# EAGLE design Controller-Board_Rack-PDU_2.0 (EAGLE 9.2.1)

## Sheet 1 of 2: MICROCONTROLLER
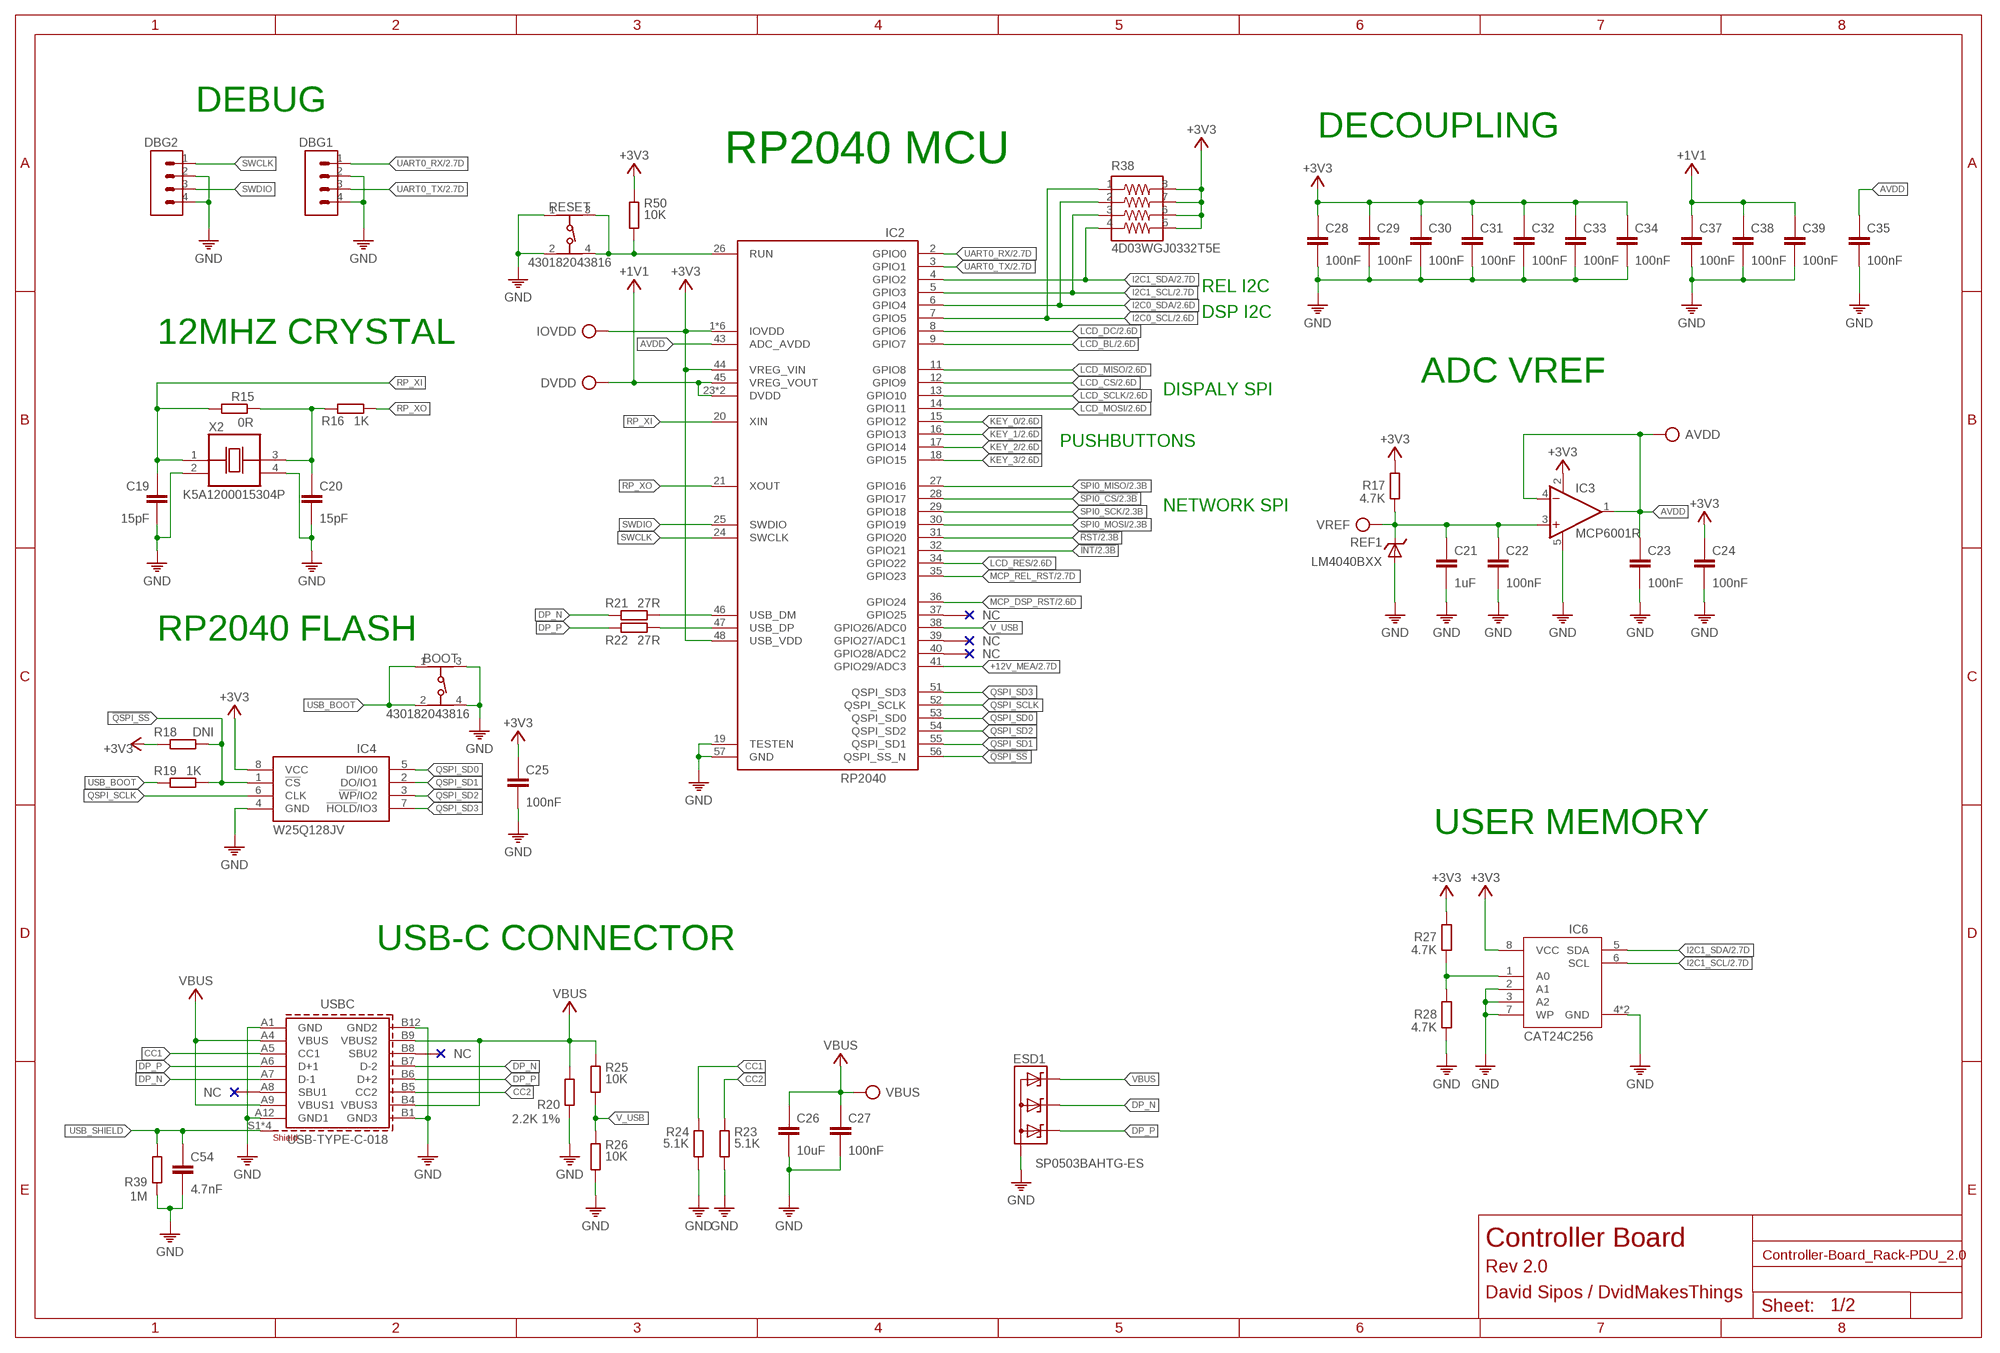
[diagram p0: schematic, sheet 1]

### Parts
AVDD  TP  [TP]
BOOT  430182043816  [430182043816]
C19  15pF  C-0402  [C0402]
C20  15pF  C-0402  [C0402]
C21  1uF  C-0402  [C0402]
C22  100nF  C-0402  [C0402]
C23  100nF  C-0402  [C0402]
C24  100nF  C-0402  [C0402]
C25  100nF  C-0402  [C0402]
C26  10uF  C0805  [0805]
C27  100nF  C0402  [0402]
C28  100nF  C-0402  [C0402]
C29  100nF  C-0402  [C0402]
C30  100nF  C-0402  [C0402]
C31  100nF  C-0402  [C0402]
C32  100nF  C-0402  [C0402]
C33  100nF  C-0402  [C0402]
C34  100nF  C-0402  [C0402]
C35  100nF  C-0402  [C0402]
C37  100nF  C-0402  [C0402]
C38  100nF  C-0402  [C0402]
C39  100nF  C-0402  [C0402]
C54  4.7nF  C0402  [0402]
DBG1  CON-1X4  [1X4]
DBG2  CON-1X4  [1X4]
DVDD  TP  [TP]
ESD1  SP0503BAHTG-ES  SP0503BAHT  [SOT143]
IC2  RP2040  [QFN40P700X700X100-57T510]
IC3  MCP6001R  MCP6001RT  [SOT23-5]
IC4  W25Q128JVPIQ  W25Q128JVP  [SON127P600X500X75-8N]
IC6  CAT24C256HU4IGT3  CAT24C256-HU4  [SON50P300X200X50-9T130X140N]
IOVDD  TP  [TP]
R15  0R  R0402  [0402]
R16  1K  R0402  [0402]
R17  4.7K  R0402  [0402]
R18  DNI  R0402  [0402]
R19  1K  R0402  [0402]
R20  2.2K 1%  R0402  [0402]
R21  27R  R0402  [0402]
R22  27R  R0402  [0402]
R23  5.1K  R0402  [0402]
R24  5.1K  R0402  [0402]
R25  10K  R0402  [0402]
R26  10K  R0402  [0402]
R27  4.7K  R0402  [0402]
R28  4.7K  R0402  [0402]
R38  4D03WGJ0332T5E  742C083103JP  [742C083103JP]
R39  1M  R0402  [0402]
R50  10K  R0402  [0402]
REF1  LM4040BXX  [SOT23]
RESET  430182043816  [430182043816]
USBC  USB-TYPE-C-018  629722000214  [629722000214]
VBUS  TP  [TP]
VREF  TP  [TP]
X2  K5A1200015304P  CRYSTAL  [OSCCC500X320X130]

### Nets
!INT: IC2.32(GPIO21) ; also sheet 2
!QSPI_SS: IC2.56(QSPI_SS_N) IC4.1(!CS) R18.1 R19.2
!RST: IC2.31(GPIO20) ; also sheet 2
!SPI0_CS: IC2.28(GPIO17) ; also sheet 2
+1V1: C37.1 C38.1 C39.1 DVDD.TP IC2.23(DVDD) IC2.45(VREG_VOUT) IC2.50(DVDD)
+3V3: C24.1 C25.1 C28.1 C29.1 C30.1 C31.1 C32.1 C33.1 C34.1 IC2.1(IOVDD) IC2.10(IOVDD) IC2.22(IOVDD) IC2.33(IOVDD) IC2.42(IOVDD) IC2.44(VREG_VIN) IC2.48(USB_VDD) IC2.49(IOVDD) IC3.2(V+) IC4.8(VCC) IC6.8(VCC) IOVDD.TP R17.2 R18.2 R27.2 R38.5 R38.6 R38.7 R38.8 R50.1 ; also sheet 2
+12V_MEA: IC2.41(GPIO29/ADC3) ; also sheet 2
AVDD: AVDD.TP C23.1 C35.1 IC2.43(ADC_AVDD) IC3.1(OUT) IC3.4(-IN)
CC1: R24.1 USBC.A5(CC1)
CC2: R23.1 USBC.B5(CC2)
DP_N [90R_DIFFPAIR]: ESD1.3(C2) R21.1 USBC.A7(D-1) USBC.B7(D-2)
DP_P [90R_DIFFPAIR]: ESD1.2(C1) R22.1 USBC.A6(D+1) USBC.B6(D+2)
GND: BOOT.3 BOOT.4 C19.2 C20.2 C21.2 C22.2 C23.2 C24.2 C25.2 C26.2 C27.2 C28.2 C29.2 C30.2 C31.2 C32.2 C33.2 C34.2 C35.2 C37.2 C38.2 C39.2 C54.2 DBG1.2 DBG1.4 DBG2.2 DBG2.4 ESD1.1(A) IC2.19(TESTEN) IC2.57(GND) IC3.5(V-) IC4.4(GND) IC6.2(A1) IC6.3(A2) IC6.4(GND) IC6.7(WP) IC6.9(GND) R20.2 R23.2 R24.2 R26.2 R28.1 R39.2 REF1.2(A) REF1.3(A) RESET.1 RESET.2 USBC.A1(GND) USBC.A12(GND1) USBC.B1(GND3) USBC.B12(GND2) X2.2(VSS) X2.4(VDD) ; also sheet 2
I2C0_SCL: IC2.7(GPIO5) R38.1 ; also sheet 2
I2C0_SDA: IC2.6(GPIO4) R38.2 ; also sheet 2
I2C1_SCL: IC2.5(GPIO3) IC6.6(SCL) R38.3 ; also sheet 2
I2C1_SDA: IC2.4(GPIO2) IC6.5(SDA) R38.4 ; also sheet 2
KEY_0: IC2.15(GPIO12) ; also sheet 2
KEY_1: IC2.16(GPIO13) ; also sheet 2
KEY_2: IC2.17(GPIO14) ; also sheet 2
KEY_3: IC2.18(GPIO15) ; also sheet 2
LCD_BL: IC2.9(GPIO7) ; also sheet 2
LCD_CS: IC2.12(GPIO9) ; also sheet 2
LCD_DC: IC2.8(GPIO6) ; also sheet 2
LCD_MISO: IC2.11(GPIO8) ; also sheet 2
LCD_MOSI: IC2.14(GPIO11) ; also sheet 2
LCD_RES: IC2.34(GPIO22) ; also sheet 2
LCD_SCLK: IC2.13(GPIO10) ; also sheet 2
MCP_DSP_RST: IC2.36(GPIO24) ; also sheet 2
MCP_REL_RST: IC2.35(GPIO23) ; also sheet 2
N$14: C20.1 R15.2 R16.1 X2.3(OUT)
N$17: IC2.26(RUN) R50.2 RESET.3 RESET.4
N$23: IC6.1(A0) R27.1 R28.2
QSPI_SCLK: IC2.52(QSPI_SCLK) IC4.6(CLK)
QSPI_SD0: IC2.53(QSPI_SD0) IC4.5(DI/IO0)
QSPI_SD1: IC2.55(QSPI_SD1) IC4.2(DO/IO1)
QSPI_SD2: IC2.54(QSPI_SD2) IC4.3(!WP!/IO2)
QSPI_SD3: IC2.51(QSPI_SD3) IC4.7(!HOLD!/IO3)
RP_XI: C19.1 IC2.20(XIN) R15.1 X2.1(CON)
RP_XO: IC2.21(XOUT) R16.2
SPI0_MISO: IC2.27(GPIO16) ; also sheet 2
SPI0_MOSI: IC2.30(GPIO19) ; also sheet 2
SPI0_SCK: IC2.29(GPIO18) ; also sheet 2
SWCLK: DBG2.1 IC2.24(SWCLK)
SWDIO: DBG2.3 IC2.25(SWDIO)
UART0_RX: DBG1.1 IC2.2(GPIO0) ; also sheet 2
UART0_TX: DBG1.3 IC2.3(GPIO1) ; also sheet 2
USB_BOOT: BOOT.1 BOOT.2 R19.1
USB_DP_N [90R_DIFFPAIR]: IC2.46(USB_DM) R21.2
USB_DP_P [90R_DIFFPAIR]: IC2.47(USB_DP) R22.2
USB_SHIELD: C54.1 R39.1 USBC.S1(SHIELD) USBC.S2(SHIELD) USBC.S3(SHIELD) USBC.S4(SHIELD)
V_USB: IC2.38(GPIO26/ADC0) R25.2 R26.1
VBUS: C26.1 C27.1 ESD1.4(C3) R20.1 R25.1 USBC.A4(VBUS) USBC.A9(VBUS1) USBC.B4(VBUS3) USBC.B9(VBUS2) VBUS.TP ; also sheet 2
VREF: C21.1 C22.1 IC3.3(+IN) R17.1 REF1.1(C) VREF.TP
Unconnected: IC2.37(GPIO25) IC2.39(GPIO27/ADC1) IC2.40(GPIO28/ADC2) USBC.A8(SBU1) USBC.B8(SBU2)

### Notes on the sheet
- DEBUG
- DECOUPLING
- RP2040 MCU
- REL I2C
- DSP I2C
- 12MHZ CRYSTAL
- ADC VREF
- DISPALY SPI
- PUSHBUTTONS
- NETWORK SPI
- RP2040 FLASH
- USER MEMORY
- USB-C CONNECTOR
- Controller Board
- Rev 2.0
- David Sipos / DvidMakesThings

## Sheet 2 of 2: NETWORK AND CONNECTORS
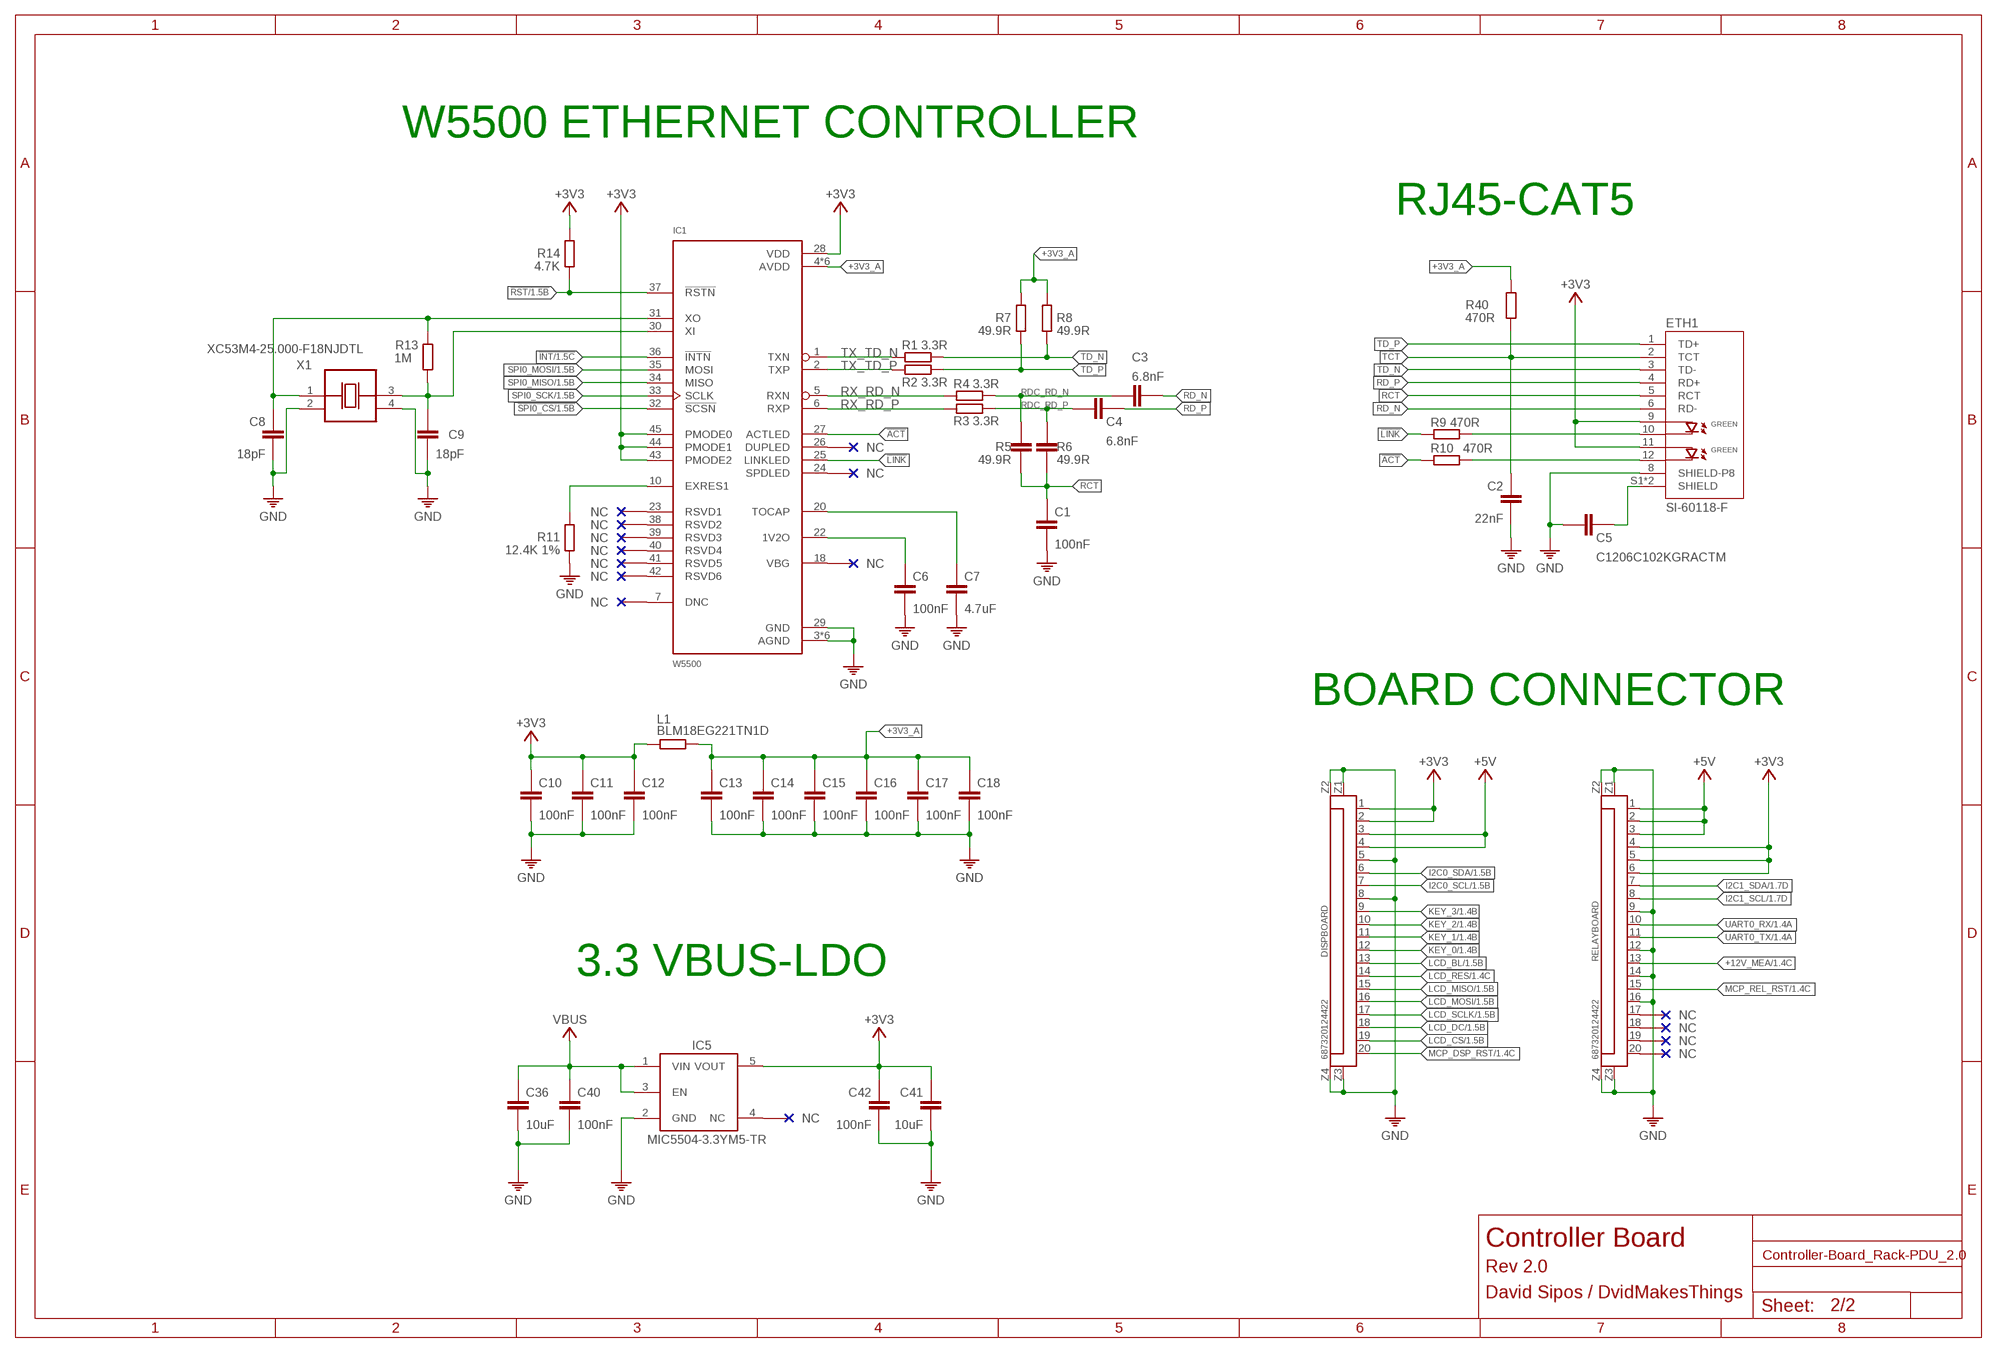
[diagram p1: schematic, sheet 2]

### Parts
C1  100nF  C-0402  [C0402]
C2  22nF  C-0402  [C0402]
C3  6.8nF  C-0402  [C0402]
C4  6.8nF  C-0402  [C0402]
C5  C1206C102KGRACTM  C-1206  [C1206]
C6  100nF  C-0402  [C0402]
C7  4.7uF  C-0402  [C0402]
C8  18pF  C-0402  [C0402]
C9  18pF  C-0402  [C0402]
C10  100nF  C-0402  [C0402]
C11  100nF  C-0402  [C0402]
C12  100nF  C-0402  [C0402]
C13  100nF  C-0402  [C0402]
C14  100nF  C-0402  [C0402]
C15  100nF  C-0402  [C0402]
C16  100nF  C-0402  [C0402]
C17  100nF  C-0402  [C0402]
C18  100nF  C-0402  [C0402]
C36  10uF  C0805  [0805]
C40  100nF  C0402  [0402]
C41  10uF  C0805  [0805]
C42  100nF  C0402  [0402]
DISPBOARD  687320124422  6873XX124422_687320124422  [687320124422]
ETH1  SI-60118-F  RJ45-CAT5  [RJ45-CAT5]
IC1  W5500  [LQFP48]
IC5  MIC5504-3.3YM5-TR  [SOT23-5]
L1  BLM18EG221TN1D  R0603  [0603]
R1  3.3R  R0402  [0402]
R2  3.3R  R0402  [0402]
R3  3.3R  R0402  [0402]
R4  3.3R  R0402  [0402]
R5  49.9R  C-0402  [C0402]
R6  49.9R  C-0402  [C0402]
R7  49.9R  R0402  [0402]
R8  49.9R  R0402  [0402]
R9  470R  R0402  [0402]
R10  470R  R0402  [0402]
R11  12.4K 1%  R0402  [0402]
R13  1M  R0402  [0402]
R14  4.7K  R0402  [0402]
R40  470R  R0402  [0402]
RELAYBOARD  687320124422  6873XX124422_687320124422  [687320124422]
X1  XC53M4-25.000-F18NJDTL  CRYSTAL  [OSCCC500X320X130]

### Nets
!ACT: IC1.27(ACTLED) R10.1
!INT: IC1.36(!INTN) ; also sheet 1
!LINK: IC1.25(LINKLED) R9.1
!RST: IC1.37(!RSTN) R14.1 ; also sheet 1
!SPI0_CS: IC1.32(!SCSN) ; also sheet 1
+3V3: C10.1 C11.1 C12.1 C41.1 C42.1 DISPBOARD.1 DISPBOARD.2 ETH1.9(GA1) ETH1.11(GA2) IC1.28(VDD) IC1.43(PMODE2) IC1.44(PMODE1) IC1.45(PMODE0) IC5.5(VOUT) L1.1 R14.2 RELAYBOARD.4 RELAYBOARD.5 RELAYBOARD.6 ; also sheet 1
+3V3_A: C13.1 C14.1 C15.1 C16.1 C17.1 C18.1 IC1.4(AVDD) IC1.8(AVDD) IC1.11(AVDD) IC1.15(AVDD) IC1.17(AVDD) IC1.21(AVDD) L1.2 R7.2 R8.2 R40.2
+5V: DISPBOARD.3 DISPBOARD.4 RELAYBOARD.1 RELAYBOARD.2 RELAYBOARD.3
+12V_MEA: RELAYBOARD.13 ; also sheet 1
CHASSIS: C5.2 ETH1.S1(SHIELD) ETH1.S2(SHIELD)
GND: C1.2 C2.2 C5.1 C6.2 C7.2 C8.2 C9.2 C10.2 C11.2 C12.2 C13.2 C14.2 C15.2 C16.2 C17.2 C18.2 C36.2 C40.2 C41.2 C42.2 DISPBOARD.5 DISPBOARD.8 DISPBOARD.Z1 DISPBOARD.Z2 DISPBOARD.Z3 DISPBOARD.Z4 ETH1.8(SHIELD-P8) IC1.3(AGND) IC1.9(AGND) IC1.14(AGND) IC1.16(AGND) IC1.19(AGND) IC1.29(GND) IC1.48(AGND) IC5.2(GND) R11.1 RELAYBOARD.9 RELAYBOARD.12 RELAYBOARD.14 RELAYBOARD.16 RELAYBOARD.Z1 RELAYBOARD.Z2 RELAYBOARD.Z3 RELAYBOARD.Z4 X1.2(VSS) X1.4(VDD) ; also sheet 1
I2C0_SCL: DISPBOARD.7 ; also sheet 1
I2C0_SDA: DISPBOARD.6 ; also sheet 1
I2C1_SCL: RELAYBOARD.8 ; also sheet 1
I2C1_SDA: RELAYBOARD.7 ; also sheet 1
KEY_0: DISPBOARD.12 ; also sheet 1
KEY_1: DISPBOARD.11 ; also sheet 1
KEY_2: DISPBOARD.10 ; also sheet 1
KEY_3: DISPBOARD.9 ; also sheet 1
LCD_BL: DISPBOARD.13 ; also sheet 1
LCD_CS: DISPBOARD.19 ; also sheet 1
LCD_DC: DISPBOARD.18 ; also sheet 1
LCD_MISO: DISPBOARD.15 ; also sheet 1
LCD_MOSI: DISPBOARD.16 ; also sheet 1
LCD_RES: DISPBOARD.14 ; also sheet 1
LCD_SCLK: DISPBOARD.17 ; also sheet 1
MCP_DSP_RST: DISPBOARD.20 ; also sheet 1
MCP_REL_RST: RELAYBOARD.15 ; also sheet 1
N$1: IC1.10(EXRES1) R11.2
N$2: ETH1.10(GK1) R9.2
N$3: ETH1.12(GK2) R10.2
N$4: C6.1 IC1.22(1V2O)
N$5: C7.1 IC1.20(TOCAP)
N$7: C9.1 IC1.30(XI) R13.1 X1.3(OUT)
RCT: C1.1 ETH1.5(RCT) R5.1 R6.1
RD_N [100R_DIFFPAIR]: C3.2 ETH1.6(RD-)
RD_P [100R_DIFFPAIR]: C4.2 ETH1.4(RD+)
RDC_RD_N [100R_DIFFPAIR]: C3.1 R4.2 R5.2
RDC_RD_P [100R_DIFFPAIR]: C4.1 R3.2 R6.2
RX_RD_N [100R_DIFFPAIR]: IC1.5(RXN) R4.1
RX_RD_P [100R_DIFFPAIR]: IC1.6(RXP) R3.1
SPI0_MISO: IC1.34(MISO) ; also sheet 1
SPI0_MOSI: IC1.35(MOSI) ; also sheet 1
SPI0_SCK: IC1.33(SCLK) ; also sheet 1
TCT: C2.1 ETH1.2(TCT) R40.1
TD_N [100R_DIFFPAIR]: ETH1.3(TD-) R1.2 R8.1
TD_P [100R_DIFFPAIR]: ETH1.1(TD+) R2.2 R7.1
TX_TD_N [100R_DIFFPAIR]: IC1.1(TXN) R1.1
TX_TD_P [100R_DIFFPAIR]: IC1.2(TXP) R2.1
UART0_RX: RELAYBOARD.10 ; also sheet 1
UART0_TX: RELAYBOARD.11 ; also sheet 1
VBUS: C36.1 C40.1 IC5.1(VIN) IC5.3(EN) ; also sheet 1
XO: C8.1 IC1.31(XO) R13.2 X1.1(CON)
Unconnected: IC1.7(DNC) IC1.18(VBG) IC1.23(RSVD1) IC1.24(SPDLED) IC1.26(DUPLED) IC1.38(RSVD2) IC1.39(RSVD3) IC1.40(RSVD4) IC1.41(RSVD5) IC1.42(RSVD6) IC5.4(NC) RELAYBOARD.17 RELAYBOARD.18 RELAYBOARD.19 RELAYBOARD.20

### Notes on the sheet
- W5500 ETHERNET CONTROLLER
- RJ45-CAT5
- BOARD CONNECTOR
- 3.3 VBUS-LDO
- Controller Board
- Rev 2.0
- David Sipos / DvidMakesThings

## Library data of the parts
AVDD DVDD IOVDD VBUS VREF = ds_passive:TP
BOOT RESET = Wurth_Switch_WS-TASV:430182043816: WS-TASV SMT Tact Switch 6x6 mm Material Properties Cover Material : Stainless Steel Properties Actuator Material:LCP Actuator Flammability :UL94 V-0 Rating Actuator Color:Black; Salmon; White Frame Material:LCP Flammability Rating:UL94 V-0 Frame Color:Black Contact Material:Stainless Steel Contact Plating:Silver Terminal Material:Copper Alloy Terminal Plating:Silver VR:12 V (DC) Contact Resistance Initial:100 mΩ Contact Resistance After Life Test:2Ω RISO:100 MΩ Withstanding Voltage:250 V (AC) Washable:No Qty.:4000;5000 Mechanical Properties Electrical Life:400; 550; 1000 Stroke :0.25 mm General Information Operating Temperature:-40 up to +85 °C Washable:No Packaging Properties Packaging:Tape and Reel <https://www.we-online.com/catalog/media/o37470v209%20Family_WS-TASV_6x6mm_SMD_Tact_Switch_4301820xx8xx.jpg> Details see: https://www.we-online.com/catalog/en/TASV_6X6_SMD/ Updated by yingchun,Shan;2020-02-18 2020(C) Würth Elektronik; DATASHEET-URL: https://www.we-online.com/redexpert/spec/430182043816?ae; HEIGHT: 4.3mm; OPERATION-FORCE: 160g; PART-NUMBER: 430182043816; QTY: 1000
C1-C42 C54 R5 R6 = ds_passive:C
DBG1 DBG2 = ds_con:CON-1X4
DISPBOARD RELAYBOARD = Wurth_Connectors_WR-FPC:6873XX124422_687320124422: WR-FPC 0.50 mm SMT ZIF Vertical KIND PROPERTIES Pitch 0.5 mm MATERIAL PROPERTIES Insulator Material LCP Contact Material Phosphor Bronze Contact Plating 100 (µ") Tin over 50 (µ") Nickel Contact Type Stamped Solder Tabs Brass <https://www.we-online.com/catalog/media/o32874v209%20Family_WE-FPC_6873xx124422.jpg> Details see: https://www.we-online.com/catalog/en/FPC_0_5_SMT_ZIF_VERTICAL_6873XX124422/ Updated by Ella Wu 2020-08-26 2020(C) Wurth Elektronik; CONTACT-RESISTANCE: 20mOhm; DATASHEET-URL: https://www.we-online.com/redexpert/spec/687320124422?ae; IR: 0.5A; L: 16.4mm; PACKAGING: Tape and Reel with Cap; PART-NUMBER: 687320124422; PINS: 20; PITCH: 0.5mm; TYPE: Vertical; WORKING-VOLTAGE: 50V(AC)
ESD1 = ds_ic_peripherals:SP0503BAHT: TVS Diode Arrays Surface Mount TVS Avalanche Diode Array
ETH1 = ds_con:RJ45-CAT5; MANUFACTURER: Bel Fuse; MAXIMUM_PACKAGE_HEIGHT: 15.21mm; PARTREV: A0; STANDARD: Manufacturer Recommendations
IC1 = ds_ic_peripherals:W5500: The W5500 chip is a Hardwired TCP/IP embedded Ethernet controller that provides easier Internet connection to embedded systems. W5500 enables users to have the Internet connectivity in their applications just by using the single chip in which TCP/IP stack, 10/100 Ethernet MAC and PHY embedded. WIZnet‘s Hardwired TCP/IP is the market-proven technology that supports TCP, UDP, IPv4, ICMP, ARP, IGMP, and PPPoE protocols. W5500 embeds the 32Kbyte internal memory buffer for the Ethernet packet processing. If you use W5500, you can implement the Ethernet application just by adding the simple socket program. It’s faster and easier way rather than using any other Embedded Ethernet solution. Users can use 8 independent hardware sockets simultaneously. SPI (Serial Peripheral Interface) is provided for easy integration with the external MCU. The W5500’s SPI supports 80 MHz speed and new efficient SPI protocol for the high speed network communication. In order to reduce power consumption of the system, W5500 provides WOL (Wake on LAN) and power down mode.
IC2 = ds_ic_mcu:RP2040
IC3 = ds_ic_opa:MCP6001RT: 1 MHz, Low-Power Op Amp
IC4 = MCU:W25Q128JV: 3V 128M-BIT SERIAL FLASH MEMORY WITH DUAL/QUAD SPI & QPI & DTR
IC5 = ds_ic_vreg:MIC5504-3.3YM5-TR: The MIC5501/2/3/4 is an advanced general-purpose LDO ideal for powering general-purpose portable devices. The MIC5501/2/3/4 family of products provides a high-performance 300mA LDO
IC6 = ds_ic_memory:CAT24C256: The CAT24C256 is a EEPROM Serial 256−Kb I2C, internally organized as 32,768 words of 8 bits each. It features a 64−byte page write buffer and supports the Standard (100 kHz), Fast (400 kHz) and Fast−Plus (1 MHz) I2C protocol. Write operations can be inhibited by taking the WP pin High (this protects the entire memory). External address pins make it possible to address up to eight CAT24C256 devices on the same bus. On−Chip ECC (Error Correction Code) makes the device suitable for high reliability applications.
L1 R1-R4 R7-R11 R13-R28 R39 R40 R50 = ds_passive:R
R38 = Resistor Array:742C083103JP: RES ARRAY 4 RES 10K OHM 1206 Manufacturer's datasheet <https://www.ctscorp.com/wp-content/uploads/74x.pdf>; CREATED_BY: PCBLayout.com; DIGIKEY_PN: 742C083103JPTR-ND; MANUFACTURER: CTS Resistor Products; MPN: 742C083103JP; PACKAGE: 1206
REF1 = ds_ic_vreg:LM4040BXX: Fixed voltage, 45-µA, precision micropower shunt voltage reference
USBC = Wurth_Connectors_WR-USB:629722000214: WR-COM USB 2.0 Type C Receptacle Horizontal SMT Kind Properties Durability 10 000 Mating cycles Gender Receptacle Type Horizontal General Information Operating Temperature -40 up to +85 °C Electrical Properties Working Voltage 20 V (DC) Withstanding Voltage 100 V (AC) Contact Resistance 40 mΩ Material Properties Insulator Material LCP Insulator Flammability Rating UL94 V-0 Insulator Color Black Contact Material Brass Contact Plating Gold over Nickel Contact Type Stamped Shielding Material Steel Shielding Plating Nickel (Ni) <https://www.we-online.com/components/media/o689297v209%20family-wr-com-629722000214.jpg> Details see: www.we-online.com/en/components/products/WR-COM_USB_20_TYPE_C_RECEPTACLE_HORIZONTAL_SMT <www.we-online.com/catalog/WR-COM_USB_20_TYPE_C_RECEPTACLE_HORIZONTAL_SMT/?utm_source=eagle_model&utm_medium=description_link&utm_campaign=eisos_eagle> Updated by Ella Wu 2023-05-30 2023 (C) Würth Elektronik; APPLICATION: USB 2.0; DATASHEET-URL: https://www.we-online.com/redexpert/spec/629722000214?ae; GERDER: Receptacle; INTERFACE-TYPE: Type C; IR: 5A; MOUNT: SMT; PACKAGING: Tape and Reel; PART-NUMBER: 629722000214; PINS: 16; TYPE: Horizontal; VALUE: 629722000214; WORKING-VOLTAGE: 20V(AC)
X1 X2 = ds_passive:CRYSTAL

## Net classes
0 default: width 0.2 mm, drill 0.15 mm, clearance 0.178 mm
1 100R_DIFFPAIR: width 0.121 mm, drill 0.15 mm, clearance 0.191 mm
2 90R_DIFFPAIR: width 0.155 mm, drill 0.15 mm, clearance 0.191 mm

## Board
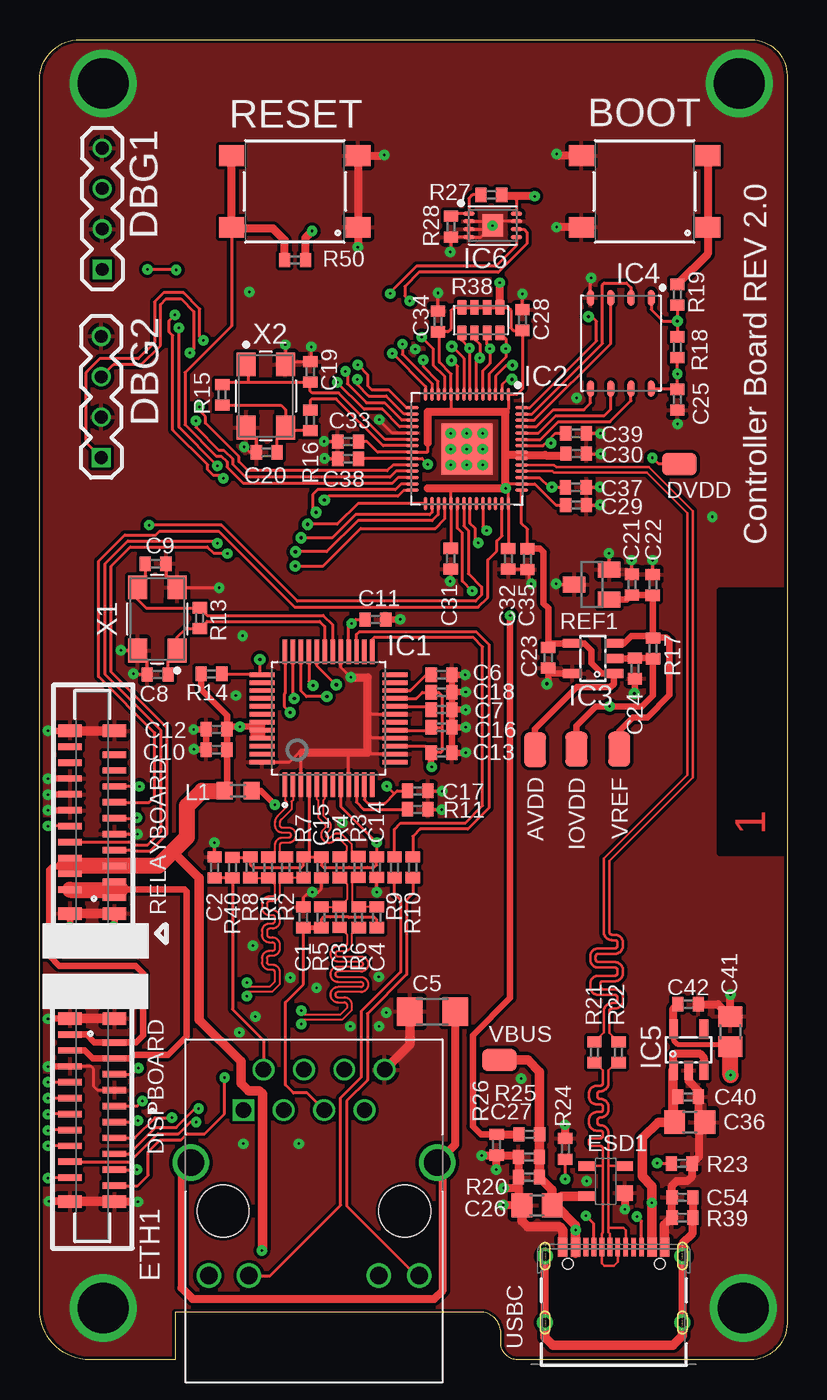
[diagram p2: board, top side]
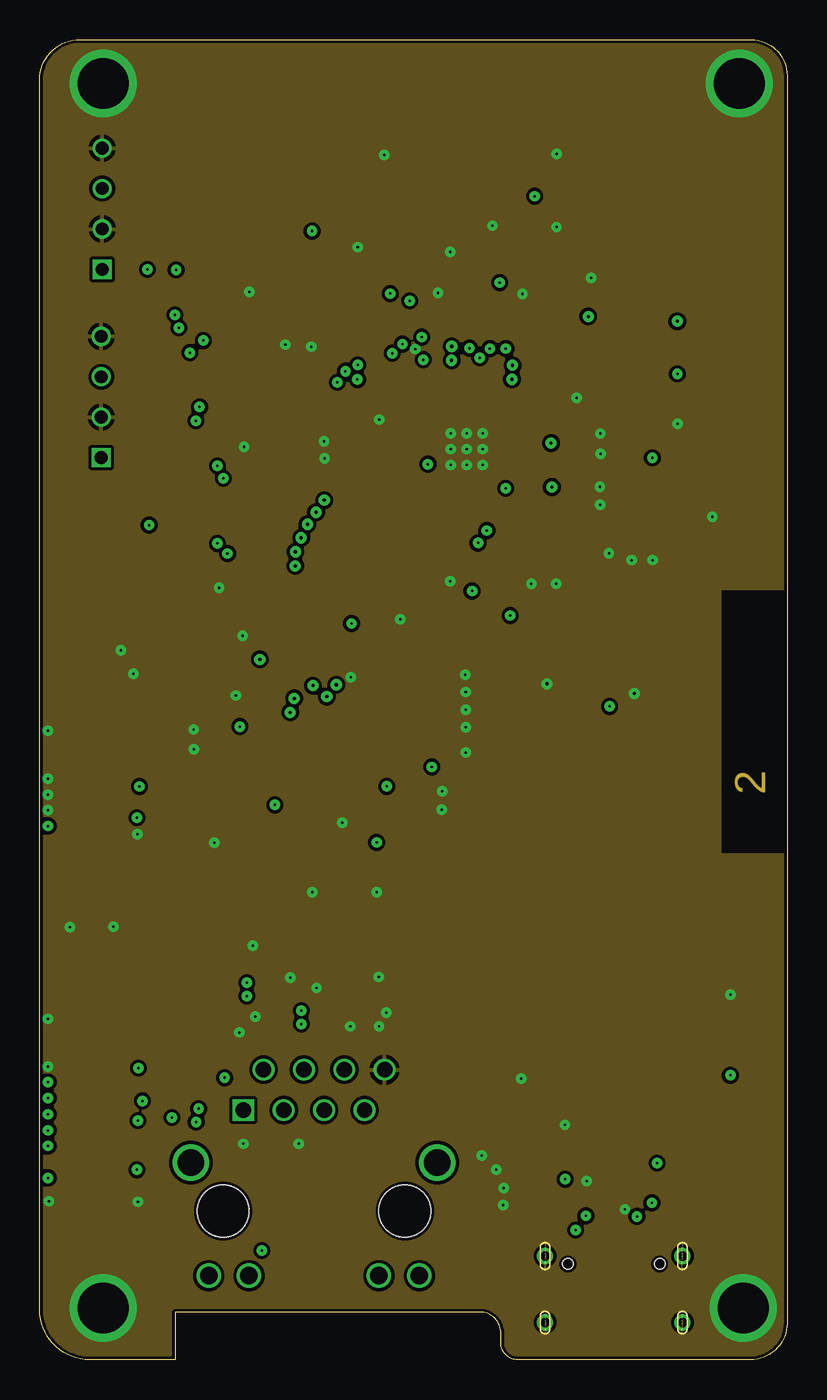
[diagram p3: board, inner layer Route2]
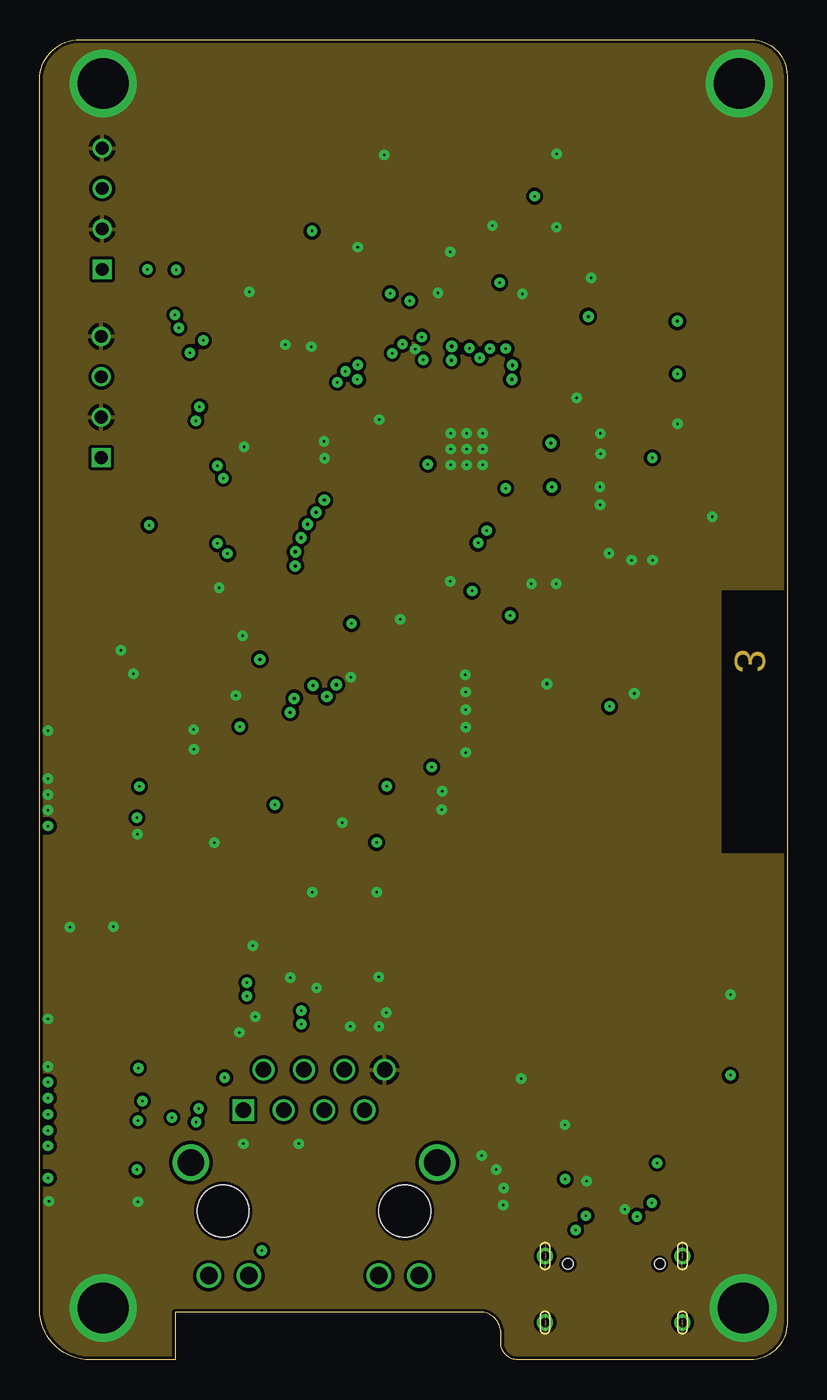
[diagram p4: board, inner layer Route15]
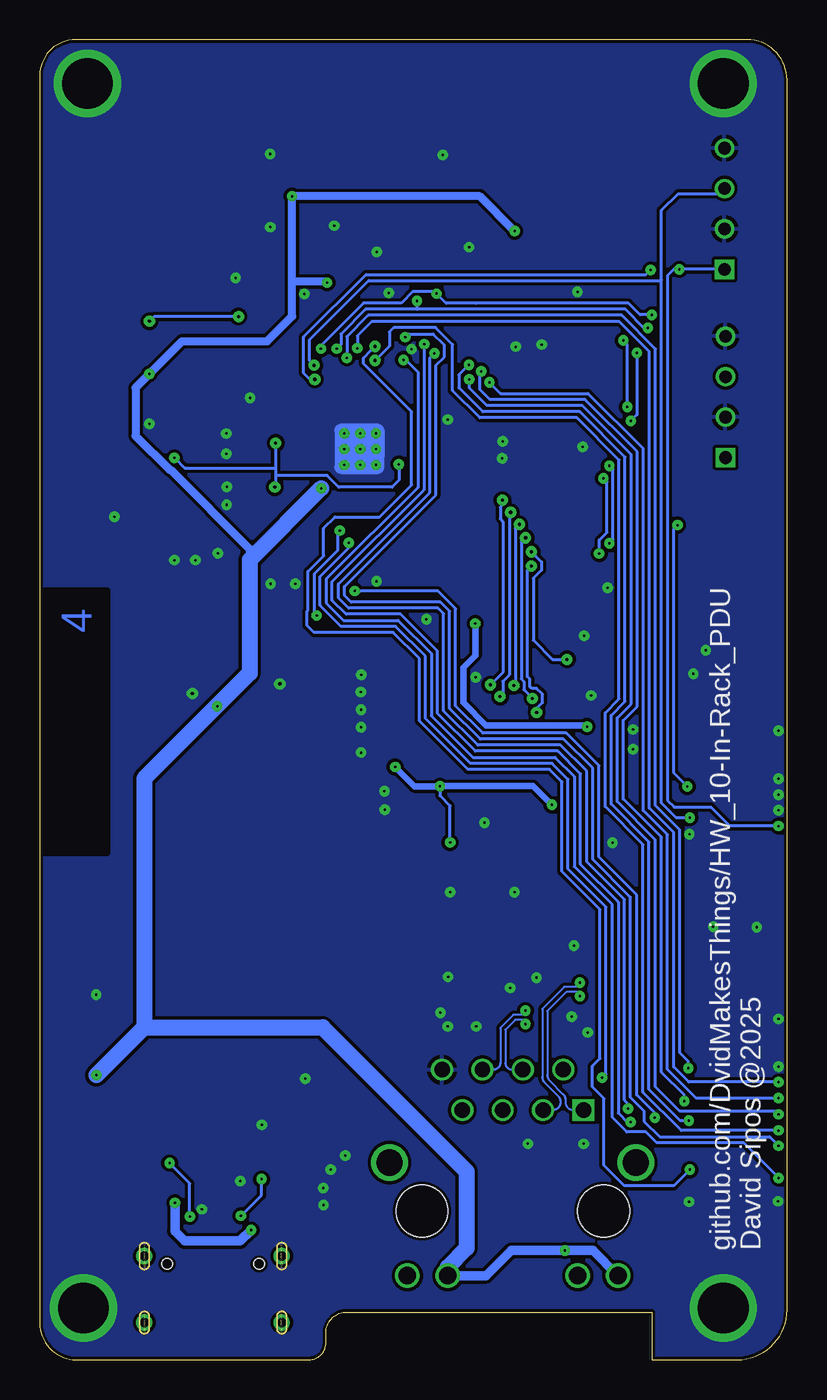
[diagram p5: board, bottom side, seen from below]

Size 47 x 83 mm. Coordinates in mm from the lower left corner, seen from the top.
Outline: 0,3.13 0,80.49 arc-90 2.51,83 44.76,83 arc-90 47,80.76 47,2.3 arc-90 44.7,0 30.06,0 arc-90 29,1.06 29,1.69 arc90 27.69,3 8.5,3 8.5,0 3.13,0 arc-90 0,3.13
Copper layers (1+2*15+16): Top 0.035mm / dielectric 0.15mm / Route2 0.0175mm / dielectric 1.265mm / Route15 0.0175mm / dielectric 0.15mm / Bottom 0.035mm
Design rules "4layers": minimum track width 3.5mil, minimum drill 0.15mm, track to track 3.5mil, track to pad 3.5mil, pad to pad 3.5mil, via to via 3.5mil, smd to smd 3.5mil, copper to edge 0.2mm, drill to drill 6mil, minimum pad ring 8mil, minimum via ring 0.25mm, stop-mask expansion 0.05mm, vias tented up to drill 16mil, thermal gap 10mil

### Footprints (pad centres in the part's own frame; a part is rotated, then mirrored left to right if it is on the bottom)
TP = smd 2.2 x 1.4: TP 0,0
430182043816 = smd 1.55 x 1.3: 1 -3.975,2.25; 2 -3.975,-2.25; 3 3.975,2.25; 4 3.975,-2.25
C0402 = smd 0.7 x 0.9: 1 -0.65,0; 2 0.65,0
C1206 = smd 1.6 x 1.803: 1 -1.422,0; 2 1.422,0
0805 = smd 1.3 x 1.5: 1 -0.95,0; 2 0.95,0
0402 = smd 0.7 x 0.9: 1 -0.65,0; 2 0.65,0
1X4 = drill 0.8 square: 1 0,3.81 | drill 0.8: 2 0,1.27; 3 0,-1.27; 4 0,-3.81
687320124422 = smd 0.4 x 1.5: 1 -4.75,-1.4; 2 -4.25,1.4; 3 -3.75,-1.4; 4 -3.25,1.4; 5 -2.75,-1.4; 6 -2.25,1.4; 7 -1.75,-1.4; 8 -1.25,1.4; 9 -0.75,-1.4; 10 -0.25,1.4; 11 0.25,-1.4; 12 0.75,1.4; 13 1.25,-1.4; 14 1.75,1.4; 15 2.25,-1.4; 16 2.75,1.4; 17 3.25,-1.4; 18 3.75,1.4; 19 4.25,-1.4; 20 4.75,1.4 | smd 0.8 x 1.5: Z1 -5.75,-1.4; Z2 -5.75,1.4; Z3 5.75,-1.4; Z4 5.75,1.4
SOT143 = smd 1 x 1: 1 -0.75,-1.2 | smd 0.6 x 1: 2 0.95,-1.2; 3 0.95,1.2; 4 -0.95,1.2
RJ45-CAT5 = drill 0.97 square: 1 -4.445,6.35 | drill 0.97: 2 -3.175,8.89; 3 -1.905,6.35; 4 -0.635,8.89; 5 0.635,6.35; 6 1.905,8.89; 7 3.175,6.35; 8 4.445,8.89 | drill 1.1: 9 -6.625,-4.06; 10 -4.085,-4.06; 11 4.085,-4.06; 12 6.625,-4.06 | drill 1.65: S1 -7.745,3.05; S2 7.745,3.05 | hole 3.25: 5.715,0; -5.715,0
LQFP48 = smd 1.56 x 0.28: 1 -4.18,2.75; 2 -4.18,2.25; 3 -4.18,1.75; 4 -4.18,1.25; 5 -4.18,0.75; 6 -4.18,0.25; 7 -4.18,-0.25; 8 -4.18,-0.75; 9 -4.18,-1.25; 10 -4.18,-1.75; 11 -4.18,-2.25; 12 -4.18,-2.75; 25 4.18,-2.75; 26 4.18,-2.25; 27 4.18,-1.75; 28 4.18,-1.25; 29 4.18,-0.75; 30 4.18,-0.25; 31 4.18,0.25; 32 4.18,0.75; 33 4.18,1.25; 34 4.18,1.75; 35 4.18,2.25; 36 4.18,2.75 | smd 0.28 x 1.56: 13 -2.75,-4.18; 14 -2.25,-4.18; 15 -1.75,-4.18; 16 -1.25,-4.18; 17 -0.75,-4.18; 18 -0.25,-4.18; 19 0.25,-4.18; 20 0.75,-4.18; 21 1.25,-4.18; 22 1.75,-4.18; 23 2.25,-4.18; 24 2.75,-4.18; 37 2.75,4.18; 38 2.25,4.18; 39 1.75,4.18; 40 1.25,4.18; 41 0.75,4.18; 42 0.25,4.18; 43 -0.25,4.18; 44 -0.75,4.18; 45 -1.25,4.18; 46 -1.75,4.18; 47 -2.25,4.18; 48 -2.75,4.18
QFN40P700X700X100-57T510 = smd 0.837 x 0.22: 1 -3.437,2.6; 2 -3.437,2.2; 3 -3.437,1.8; 4 -3.437,1.4; 5 -3.437,1; 6 -3.437,0.6; 7 -3.437,0.2; 8 -3.437,-0.2; 9 -3.437,-0.6; 10 -3.437,-1; 11 -3.437,-1.4; 12 -3.437,-1.8; 13 -3.437,-2.2; 14 -3.437,-2.6; 29 3.437,-2.6; 30 3.437,-2.2; 31 3.437,-1.8; 32 3.437,-1.4; 33 3.437,-1; 34 3.437,-0.6; 35 3.437,-0.2; 36 3.437,0.2; 37 3.437,0.6; 38 3.437,1; 39 3.437,1.4; 40 3.437,1.8; 41 3.437,2.2; 42 3.437,2.6 | smd 0.22 x 0.837: 15 -2.6,-3.437; 16 -2.2,-3.437; 17 -1.8,-3.437; 18 -1.4,-3.437; 19 -1,-3.437; 20 -0.6,-3.437; 21 -0.2,-3.437; 22 0.2,-3.437; 23 0.6,-3.437; 24 1,-3.437; 25 1.4,-3.437; 26 1.8,-3.437; 27 2.2,-3.437; 28 2.6,-3.437; 43 2.6,3.437; 44 2.2,3.437; 45 1.8,3.437; 46 1.4,3.437; 47 1,3.437; 48 0.6,3.437; 49 0.2,3.437; 50 -0.2,3.437; 51 -0.6,3.437; 52 -1,3.437; 53 -1.4,3.437; 54 -1.8,3.437; 55 -2.2,3.437; 56 -2.6,3.437 | smd 3.2 x 3.2: 57 0,0
SOT23-5 = smd 0.55 x 1.2: 1 -0.95,-1.3; 2 0,-1.3; 3 0.95,-1.3; 4 0.95,1.3; 5 -0.95,1.3
SON127P600X500X75-8N = smd 1.012 x 0.432: 1 -2.85,1.905; 2 -2.85,0.635; 3 -2.85,-0.635; 4 -2.85,-1.905; 5 2.85,-1.905; 6 2.85,-0.635; 7 2.85,0.635; 8 2.85,1.905
SON50P300X200X50-9T130X140N = smd 0.711 x 0.27: 1 -1.501,0.75; 2 -1.501,0.25; 3 -1.501,-0.25; 4 -1.501,-0.75; 5 1.501,-0.75; 6 1.501,-0.25; 7 1.501,0.25; 8 1.501,0.75 | smd 1.3 x 1.4: 9 0,0
0603 = smd 1 x 1.1: 1 -0.85,0; 2 0.85,0
742C083103JP = smd 0.59 x 0.92: 1 -1.2,-0.8; 2 -0.4,-0.8; 3 0.4,-0.8; 4 1.2,-0.8; 5 1.2,0.8; 6 0.4,0.8; 7 -0.4,0.8; 8 -1.2,0.8
SOT23 = smd 1 x 1.4: 1 -0.95,-1.1; 2 0.95,-1.1; 3 0,1.1
629722000214 = smd 0.3 x 1.15: A1 -3.35,4.745; A4 -2.55,4.745; A5 -1.25,4.745; A6 -0.25,4.745; A7 0.25,4.745; A8 1.25,4.745; A9 2.55,4.745; A12 3.35,4.745; B1 3.05,4.745; B4 2.25,4.745; B5 1.75,4.745; B6 0.75,4.745; B7 -0.75,4.745; B8 -1.75,4.745; B9 -2.25,4.745; B12 -3.05,4.745 | drill 0.6 pad 1: S1 -4.32,4.18; S2 4.32,4.18; S3 -4.32,0; S4 4.32,0 | hole 0.65: -2.89,3.68; 2.89,3.68
OSCCC500X320X130 = smd 1.487 x 1.187: 1 -1.988,-1.238; 2 1.988,-1.238; 3 1.988,1.238; 4 -1.988,1.238

### Placement (x,y rotation side)
AVDD  31.15,38.36 270 top
BOOT  38.04,73.46 180 top
C1  16.58,27.82 90 top
C2  10.99,30.95 90 top
C3  18.86,27.84 270 top
C4  20.06,27.82 270 top
C5  24.7,21.89 0 top
C6  25.27,43.07 0 top
C7  25.27,40.88 0 top
C8  7.42,43.09 180 top
C9  7.29,50.05 0 top
C10  11.12,38.36 180 top
C11  21.11,46.55 0 top
C12  11.12,39.64 180 top
C13  25.27,38.17 0 top
C14  21.19,30.97 270 top
C15  17.71,30.95 270 top
C16  25.27,39.77 0 top
C17  23.77,35.77 0 top
C18  25.27,41.97 0 top
C19  17.01,62.12 90 top
C20  14.27,57.06 180 top
C21  37.24,48.74 90 top
C22  38.55,48.72 90 top
C23  31.98,44.14 270 top
C24  37.43,43.47 270 top
C25  40.11,60.36 270 top
C26  31.27,9.71 180 top
C27  30.77,12.75 180 top
C28  30.36,65.37 90 top
C29  33.73,53.74 0 top
C30  33.73,56.98 0 top
C31  25.85,50.37 270 top
C32  29.47,50.36 270 top
C33  19.39,57.74 180 top
C34  25.04,65.28 90 top
C35  30.67,50.34 270 top
C36  40.88,14.94 0 top
C37  33.72,54.86 0 top
C38  19.4,56.65 180 top
C39  33.72,58.25 0 top
C40  40.78,16.54 0 top
C41  43.43,20.63 90 top
C42  40.78,22.36 0 top
C54  40.42,10.21 180 top
DBG1  3.93,72.37 180 top
DBG2  3.87,60.54 180 top
DISPBOARD  3.3,15.7 270 top
DVDD  40.23,56.32 0 top
ESD1  35.59,11.23 90 top
ETH1  17.25,9.35 0 top
IC1  18.17,40.33 90 top
IC2  26.87,57.27 270 top
IC3  34.8,44.1 90 top
IC4  36.55,63.92 270 top
IC5  40.81,19.49 0 top
IC6  28.49,71.33 0 top
IOVDD  33.75,38.4 270 top
L1  12.48,35.77 0 top
R1  14.38,30.95 270 top
R2  15.48,30.95 270 top
R3  20.03,30.98 270 top
R4  18.88,30.96 270 top
R5  17.7,27.82 90 top
R6  21.2,27.82 90 top
R7  16.59,30.96 90 top
R8  13.24,30.96 90 top
R9  22.31,30.96 270 top
R10  23.46,30.96 270 top
R11  23.77,34.61 180 top
R13  10.06,46.63 270 top
R14  10.8,43.13 180 top
R15  11.48,60.67 270 top
R16  17.01,59.07 90 top
R17  38.57,44.72 270 top
R18  40.11,63.67 270 top
R19  40.11,66.97 270 top
R20  30.77,11.48 180 top
R21  34.88,19.34 90 top
R22  36.4,19.34 90 top
R23  40.38,12.34 0 top
R24  33.05,13.26 90 top
R25  30.79,14.18 180 top
R26  28.73,13.52 270 top
R27  28.41,73.25 0 top
R28  25.86,71.25 90 top
R38  27.74,65.37 0 top
R39  40.42,8.94 180 top
R40  12.12,30.95 90 top
R50  16.06,69.14 180 top
REF1  34.72,48.74 90 top
RELAYBOARD  3.3,33.8 90 top
RESET  16.04,73.46 180 top
U$1  [4-LAYER]  46.58,31.86 90 top
USBC  36.1,2.34 0 top
VBUS  28.91,18.85 0 top
VREF  36.45,38.4 270 top
X1  7.39,46.58 90 top
X2  14.22,60.6 270 top

### Tracks (layer width: path | path; a pad name or v marks a point on that pad's centre or on a via)
!ACT
  Top 0.203: IC1.27 19.92,45.6 20.1,45.78 27.44,45.78 28.24,44.98 28.24,34.69 26.92,33.37 23.92,33.37 23.46,32.91 R10.1
!INT  (via drill 0.2 pad 0.3)
  Top 0.2: IC2.32 25.47,52.87 24.88,52.28 20.18,52.28 17.82,49.91 v16.07,49.91 | IC1.36 15.42,41.89 15.38,41.85 15.38,41.08 v15.75,40.71
  Bottom 0.2: v15.75,40.71 15.75,40.95 15.38,41.33 15.38,41.85 15.75,42.21 16.07,42.21 16.18,42.32 16.18,42.81 16.33,42.96 16.33,49.65 v16.07,49.91
!LINK
  Top 0.203: R9.1 22.31,33.36 22.7,33.75 26.76,33.75 27.86,34.85 27.86,44.82 27.28,45.4 21.02,45.4 20.92,45.3 IC1.25
!QSPI_SS  (via drill 0.2)
  Top 0.2: IC2.56 30.83,59.87 35.02,64.06 35.02,65.3 34.72,65.6 v34.5,65.6 | v40.1,65.3 R18.1 | IC4.1 38.45,66.05 39.2,65.3 v40.1,65.3 | R19.2 v40.1,65.3
  Bottom 0.2: v34.5,65.6 39.8,65.6 v40.1,65.3
!RST  (via drill 0.2 pad 0.3)
  Top 0.2: IC1.37 13.82,43.08 | 13.82,43.08 11.5,43.08 R14.1 | IC2.31 25.06,53.82 25.06,53.14 24.67,52.76 20,52.76 18.05,50.8 v16.08,50.8 | v13.84,44.04 13.84,43.1 13.82,43.08
  Bottom 0.2: v16.08,50.8 15.82,50.54 15.81,50.54 15.44,50.17 15.44,49.65 15.95,49.14 15.95,45.25 14.74,44.04 v13.84,44.04
!SPI0_CS  (via drill 0.2 pad 0.3)
  Top 0.2: IC1.32 17.42,43.67 v18.65,42.44 | v17.9,54.05 18.15,54.3 22.53,54.3 22.9,54.67 IC2.28
  Bottom 0.2: v18.65,42.44 17.84,43.25 17.84,52.68 18.04,52.88 18.04,53.6 17.9,53.74 v17.9,54.05
+1V1  (via drill 0.15, 0.2)
  Top 0.2: IC2.23 20.07,56.67 C38.1 | IC2.50 31.65,57.47 31.99,57.81 | 31.99,57.81 32.44,58.26 C39.1 | 31.99,57.81 v32.16,57.64
  Top 0.203: IC2.45 31.43,55.47 32.04,54.86 | 32.04,54.86 C37.1 | 32.04,54.86 32.06,54.87 v32.22,54.87 | IC2.23 24.05,56.67 v24.41,56.31 | DVDD.TP 38.93,56.32 v38.53,56.72
  Bottom 0.203: v32.16,57.64 32.16,56.07 | 32.16,56.07 32.16,55.63 | 32.16,55.63 32.16,54.93 v32.22,54.87 | v24.41,56.31 24.41,55.3 24.84,54.87 28.2,54.87 28.93,55.6 32.13,55.6 32.16,55.63 | v38.53,56.72 37.88,56.07 32.16,56.07
+3V3  (via drill 0.15)
  Top 0.2: IC2.33 25.87,51.04 C31.1 | IC2.42 C32.1 | IC2.22 21.25,57.07 20.58,57.74 C33.1 | IC2.1 30.03,60.71 30.38,61.06 30.38,64.7 C28.1 29.8,64.72 29.63,64.89 29.63,65.99 29.45,66.17 R38.5 R38.6 R38.7 R38.8 26.04,66.17 25.85,65.98 25.85,64.81 25.67,64.63 C34.1 25.13,64.55 25.13,62.72 25.87,61.98 IC2.10 | IC4.8 40.05,61.07 C25.1 v40.11,61.99 R18.2 | IC2.49 30.31,56.9 IC2.48
  Top 0.203: C29.1 32.45,53.74 31.13,55.07 IC2.44 29.33,55.07 29.3,55.1 | IC2.42 29.47,54.63 v29.3,54.8 | IC2.33 25.87,54.77 25.9,54.8 | IC2.22 24.37,57.07 24.4,57.1 24.4,57.63 24.39,57.64 | IC2.1 29.47,59.77 29.3,59.6 | IC2.10 25.87,59.67 25.8,59.6 | IC1.43 13.99,39.96 | 13.99,39.81 IC1.44 13.99,39.35 13.99,39.26 IC1.45 | IC1.28 19.42,46.1 v19.6,46.28 | C11.1 19.87,46.55 v19.61,46.29 | R27.2 29.64,73.25 29.99,72.9 IC6.8
  Top 0.305: IC5.5 39.86,20.09 40.11,19.84 43.27,19.84 C41.1 | RELAYBOARD.5 4.72,31.07 7.47,31.07
  Top 0.406: IC3.2 37.4,44.1 C24.1 38.52,44.12 R17.2 38.57,41.77 37.88,41.08 v35.84,41.08 34.98,41.08 33.75,39.85 IOVDD.TP | L1.1 11.77,35.91 C10.1 C12.1 | 13.99,39.81 13.46,39.81 | 13.46,39.81 v12.58,39.81 11.94,39.81 C12.1 | 13.99,39.35 13.58,39.35 13.48,39.25 13.46,39.27 13.46,39.81 | 13.99,39.81 13.99,39.26 | 13.99,39.81 13.99,39.96 | C12.1 11.77,40.51 10.15,42.13 R14.2 | v19.6,46.28 v19.61,46.29 | DISPBOARD.1 2.94,20.45 3.44,19.95 DISPBOARD.2 6.05,19.95 6.51,20.41 6.51,24.29 6.03,24.77 1.23,24.77 0.59,25.41 0.59,30.81 0.81,31.03 1.5,31.03 1.54,31.07 | RELAYBOARD.6 1.54,31.19 1.54,31.07 | 1.54,31.07 1.54,30.91 RELAYBOARD.4
  Top 0.508: C30.1 32.96,56.86 31.84,56.86 31.79,56.9 30.31,56.9 29.3,56.9 | 29.3,55.1 29.3,56.9 | 29.3,56.9 29.3,59.6 25.8,59.6 24.4,59.6 24.39,59.59 24.39,57.64 | 24.4,54.8 25.9,54.8 v29.3,54.8 29.3,55 | IC5.5 39.86,22.09 C42.1 | v31.13,73.16 29.14,73.16 R27.2 | R50.1 16.71,70.55 v17.13,70.97 | R38.5 28.94,67.72 v28.93,67.73
  Top 0.61: 8.37,31.96 10.04,30.29 10.04,21.38 12.67,18.75 12.67,17.38 13.15,16.9 13.81,16.9 14,16.71 14,6.9 v13.97,6.87
  Top 1.016: 1.54,31.07 7.47,31.07 8.37,31.96 9.26,32.86 9.26,34.83 10.2,35.77 L1.1 | v43.44,17.89 C41.1
  Bottom 0.406: v19.61,46.29 19.61,44.29 20.36,43.54 20.36,41.32 18.93,39.89 12.66,39.89 v12.58,39.81 | v35.84,41.08 35.84,41.14 35.47,41.51
  Bottom 0.508: 33.8,50.3 33.8,50.99 38.77,55.96 38.84,55.96 40.97,58.09 40.97,61.13 v40.11,61.99 38.06,64.04 32.7,64.04 31.13,65.61 31.13,67.79 | 31.13,67.79 v31.13,73.16 19.32,73.16 v17.13,70.97 | v28.93,67.73 28.99,67.79 31.13,67.79
  Bottom 0.61: ETH1.11 18.92,5.29 17.34,6.87 v13.97,6.87 12.21,6.87 ETH1.9
  Bottom 1.016: v29.3,54.8 33.8,50.3 33.8,43.18 35.47,41.51 40.43,36.55 40.43,20.9 | 40.43,20.9 v43.44,17.89 | 40.43,20.9 29.21,20.9 20.15,11.84 20.15,7.01 21.34,5.83 ETH1.11
+3V3_A  (via drill 0.15)
  Top 0.2: R40.2 13.22,31.59 R8.2 13.24,31.12 13.41,30.95 16.46,30.95 16.59,31.08 R7.2 | R7.2 C15.1 17.71,31.09 17.84,30.96 19.45,30.96 19.46,30.97 20.6,30.97 20.61,30.96 21.04,30.96 21.19,31.11 C14.1 v21.19,32.53 18.92,34.8 IC1.8 | IC1.4 16.92,31.94 R7.2
  Top 0.203: C17.1 22.48,35.77 22.34,35.62 | 22.34,35.62 21.7,34.99 20.64,34.99 20.42,35.21 IC1.11 | IC1.17 24.43,39.58 C16.1 25.29,39.77 | IC1.15 24.21,38.58 C13.1 25.21,38.17 25.29,38.25 25.29,39.77 | IC1.21 23.68,41.58 24.07,41.97 C18.1 25.1,41.97 25.29,41.78 25.29,39.77 | v21.83,36.05 22.26,35.62 22.34,35.62
  Top 0.406: C13.1 24.62,37.3 v24.65,37.27 | L1.2 13.91,35.77 v14.79,34.89
  Bottom 0.203: v21.83,36.05 21.83,35.47 21.19,34.83 v21.19,32.53
  Bottom 0.406: v24.65,37.27 23.43,36.05 v21.83,36.05 21.81,36.07 15.97,36.07 v14.79,34.89
+5V
  Top 0.254: RELAYBOARD.3 4.7,29.58 RELAYBOARD.1
  Top 0.406: DISPBOARD.3 2.83,19.45 3.33,18.95 DISPBOARD.4 5.71,18.95 5.94,19.18 8.07,19.18 9.23,20.34 9.23,29.46 9.11,29.58 5.21,29.58
  Top 0.813: 4.7,29.58 5.21,29.58
  Top 1.016: RELAYBOARD.2 4.67,29.55 4.7,29.58
+12V_MEA
  Top 0.203: RELAYBOARD.13 6.87,35.05 7.24,35.42 7.24,39.42 3.7,42.96 3.7,50.22 5.35,51.87 7.3,51.87 7.53,52.1 11.26,52.1 16.03,47.33 27.57,47.33 28.18,47.93 28.18,50.3 28.74,50.86 28.74,51.48 29.07,51.81 IC2.41
AVDD
  Top 0.2: C35.1 30.67,52.23 30.31,52.59 IC2.43
  Top 0.406: AVDD.TP 31.15,39.65 33.8,42.3 35.9,42.3 36.1,42.5 IC3.1 35.35,43.15 34.7,43.8 34.7,44.6 34.25,45.05 IC3.4 32.24,45.05 C23.1 31.98,47.25 31.68,47.55 31.68,50.78 31.47,50.99 C35.1
CC1  (via drill 0.15)
  Top 0.203: USBC.A5 34.85,8.55 v34.35,9.05 | v33.05,11.35 R24.1
  Bottom 0.203: v34.35,9.05 33.05,10.35 v33.05,11.35
CC2  (via drill 0.15)
  Top 0.203: USBC.B5 37.85,8.72 v37.56,9.01 | v38.83,12.36 38.85,12.34 R23.1
  Bottom 0.203: v37.56,9.01 37.56,11.09 v38.83,12.36
CHASSIS
  Top 0.508: C5.2 26.12,13.53 ETH1.S2 25.36,12.04 25.36,4.37 24.81,3.82 9.61,3.82 8.91,4.52 8.91,11.8 ETH1.S1
DP_N
  Top 0.155: ESD1.3 34.41,12.2 35.43,12.2 | 35.43,12.2 35.43,13.27 arc90 35.26,13.44 34.71,13.44 arc-90 34.54,13.61 34.54,13.75 arc-90 34.71,13.92 35.26,13.92 arc90 35.43,14.09 35.43,14.23 arc90 35.26,14.4 35.05,14.4 arc-90 34.54,14.92 34.54,15.06 arc-90 35.05,15.57 35.26,15.57 arc90 35.43,15.75 35.43,15.88 arc90 35.26,16.06 35.05,16.06 arc-90 34.54,16.57 34.54,16.71 arc-90 35.05,17.23 35.26,17.23 arc90 35.43,17.4 35.43,18.2 34.94,18.69 R21.1 | 35.43,12.2 35.43,8 35.35,7.92 USBC.B7 35.35,6.05 35.5,5.9 36.1,5.9 36.35,6.15 USBC.A7
DP_P
  Top 0.155: ESD1.2 36.77,12.2 35.77,12.2 | 35.77,12.2 35.77,14.23 arc90 35.26,14.75 arc-90 35.08,14.92 35.08,15.06 arc-90 35.26,15.23 arc90 35.77,15.75 35.77,15.88 arc90 35.26,16.4 35.25,16.4 arc-90 35.08,16.57 35.08,16.71 arc-90 35.25,16.88 35.26,16.88 arc90 35.77,17.4 35.77,18.2 36.26,18.69 R22.1 | USBC.A6 35.85,7.92 35.77,8 35.77,8.3 | 35.77,8.3 35.77,12.2 | USBC.B6 36.85,8.15 36.7,8.3 35.77,8.3
GND  (via drill 0.15, 0.2, 3.2 pad 4)
  Top 0.2: C8.2 6.76,43.98 X1.4 | C9.2 7.93,49.27 X1.2 | C20.2 13.62,57.97 X2.2 | X2.4 15.64,62.77 C19.2 | C1.2 16.58,29.06 16.91,29.39 v17.14,29.39 17.49,29.39 17.71,29.61 C15.2 | C14.2 v21.19,29.39 | C2.2 10.99,32.49 v10.98,32.51
  Top 0.203: USBC.A1 32.9,7.08 USBC.B12 | USBC.B1 39.3,7.08 USBC.A12 | IC1.29 18.92,43.56 v19.57,42.91 | IC1.14 20.72,38.08 20.62,38.18 | IC1.16 20.74,39.08 20.62,39.2 | IC1.19 20.68,40.58 20.62,40.64 | IC1.9 19.42,38.18 19.46,38.18 19.42,38.14 | IC1.3 16.42,37.93 | 16.42,37.93 16.42,38.3 15.7,37.58 IC1.48 | RELAYBOARD.9 v6.13,33.05 v6.14,33.04 | IC2.19 22.16,58.27 21.34,59.09 v21.34,59.11 | 16.42,37.93 16.48,37.99 16.48,38.18 | X1.2 11.26,48.57 v11.28,48.55 | X1.4 5.14,44.59 v5.11,44.62 | C8.2 5.93,43.09 v5.89,43.13 | REF1.2 35.82,50.69 v35.8,50.71 | C21.2 37.24,50.26 v37.22,50.28 | C22.2 v38.55,50.27 v38.54,50.28 | REF1.3 32.54,48.74 v32.48,48.8 | C32.2 30.65,49.71 C35.2 30.76,49.6 30.76,48.95 v30.92,48.79 | C31.2 25.85,48.97 v25.82,48.94 | C37.2 35.21,54.86 v35.23,54.88 | C29.2 v35.24,53.74 v35.25,53.75 | C20.2 13.2,57.06 v12.85,57.41 | C33.2 v17.88,57.74 | v17.91,56.67 18.73,56.67 C38.2 | v17.07,63.7 17.07,62.83 C19.2 | v15.44,63.83 15.46,63.81 X2.4 | C34.2 v25.05,67.08 | C28.2 v30.36,67.02 | IC4.4 34.65,67.98 v34.68,68.02 | R28.1 25.86,70.58 | 25.86,70.58 25.86,69.72 v25.81,69.67 | IC6.4 25.86,70.58 | IC6.4 IC6.3 | IC6.3 IC6.2 28.2,71.58 v28.47,71.31 28.24,71.08 | IC6.3 28.24,71.08 | IC6.4 27.74,70.58 28.24,71.08 | IC6.7 28.74,71.58 IC6.9 | DISPBOARD.8 3.64,16.95 3.39,17.2 3.39,18.28 3.22,18.45 DISPBOARD.5 | C30.2 34.4,56.96 v35.27,56.96 | C39.2 35.25,58.25 v35.26,58.24 | C17.2 25.29,35.77 v25.32,35.74 | R11.1 25.26,34.61 v25.29,34.58
  Top 0.406: IC3.5 32.32,43.15 C23.2 31.98,42.58 v31.9,42.5 | C24.2 37.43,41.93 v37.4,41.9 | C18.2 C7.2 | C7.2 C16.2 | C18.2 C6.2 v26.77,43.07 | C18.2 25.94,41.99 v26.8,41.99 | C7.2 v26.79,40.88 | C16.2 v26.78,39.77 v26.79,39.78 | C16.2 C13.2 26.77,38.16 v26.79,38.18 | v9.69,38.38 9.71,38.36 C10.2 C12.2 v9.69,39.64 v9.68,39.63 | v22.68,46.56 v22.67,46.55 C11.2 | DISPBOARD.5 v0.54,18.45 v0.53,18.44 | DISPBOARD.Z1 0.55,21.45 v0.53,21.43 | RELAYBOARD.12 v0.54,34.55 v0.53,34.56 | RELAYBOARD.14 0.55,35.55 v0.53,35.53 | RELAYBOARD.16 v0.54,36.55 v0.53,36.54 | RELAYBOARD.Z4 v0.53,39.55 | RELAYBOARD.Z1 4.7,27.29 v4.64,27.23 | RELAYBOARD.Z2 v1.9,27.19
  Top 0.508: C42.2 42.65,22.36 C41.2 43.43,22.94 v43.45,22.96 | IC5.2 40.81,17.53 41.43,16.91 C40.2 41.43,15.34 C36.2 41.47,14.58 41.47,12.78 R23.2 41.03,11.54 40.73,11.24 40.06,11.24 39.77,10.95 C54.2 R39.2 | 30.12,10.77 R20.2 C27.2 30,12.87 R26.2 28.7,12.83 | 30.12,10.77 30.12,9.91 C26.2 29.17,9.71 v29.15,9.73 | R24.2 33.05,14.75 v33.03,14.77 | 28.7,12.83 v28.7,11.96 | ESD1.1 v36.79,9.47 v36.8,9.46 | 30.12,10.77 29.19,10.77 v29.17,10.79 | 28.7,12.83 v27.79,12.83 | 19.46,38.18 20.62,38.18 20.62,39.2 20.62,40.64 20.62,42.91 v19.57,42.91 | DISPBOARD.Z4 6.15,9.95 v6.17,9.93 | DISPBOARD.Z3 v0.58,9.95 v0.57,9.96 | 16.48,38.18 19.42,38.18 | BOOT.3 v32.51,71.21 v32.5,71.22 | BOOT.4 32.63,75.71 v32.51,75.83 | v21.66,75.76 21.61,75.71 RESET.2 RESET.1 20.02,69.97 v20,69.96
  Top 0.61: C26.2 30.32,8.73 30.7,8.35 32.7,8.35 32.9,8.15 32.9,7.08 | R39.2 39.3,8.48 39.3,7.08 | C5.1 23.28,19.82 ETH1.8 | RELAYBOARD.Z2 RELAYBOARD.Z1 | RELAYBOARD.Z4 RELAYBOARD.Z3 | DISPBOARD.Z1 DISPBOARD.Z2 | DISPBOARD.Z3 DISPBOARD.Z4
  Bottom 0.813: 25.73,56.75 25.73,56.11 28.05,56.11 28.05,58.45 25.73,58.45 25.73,56.75 | 25.73,56.75 27.69,56.75 27.69,57.47 26.11,57.47 26.11,58.04 27.57,58.04
  other vias: 17.41,23.38 21.32,24.07 15.76,24.02 13.4,26.03 13.55,21.58 19.54,20.96 21.34,20.96 21.8,21.82 40.11,58.85 26.85,57.26 25.85,57.26 25.85,58.26 26.85,58.26 27.85,58.26 27.85,57.26 27.85,56.26 26.85,56.26 25.85,56.26 4,3.25 44.25,3.25 4,80.25 44,80.25 12.8,13.58 16.3,13.58 12.55,20.58 19.03,33.77 12.76,45.53 12.33,41.77 33.77,60.49 23.62,63.55 13.18,67.15 30.29,17.67 34.39,11.24 42.3,53.01
  pour Route2 (isolate 0.203): -5.26,83.75 47.5,83.75 47.5,48.5 42.75,48.5 42.75,31.75 47.5,31.75 47.5,31.5 47.41,-0.25 -5.26,-0.25
  pour Top (isolate 0.203): -6.01,83.65 47.5,83.65 47.5,48.5 42.75,48.5 42.75,31.75 47.5,31.75 47.48,-0.3 -6.01,-0.3
  pour Route15 (isolate 0.203): -4.75,83.7 47.36,83.7 47.5,48.5 42.75,48.5 42.75,31.75 47.5,31.75 47.5,-0.22 -4.75,-0.22
  pour Bottom (isolate 0.203): -3.68,83.65 47.46,83.65 47.5,48.5 42.75,48.5 42.75,31.75 47.5,31.75 47.5,-0.21 -3.68,-0.21
I2C0_SCL  (via drill 0.15)
  Top 0.2: R38.1 26.54,64.11 26.96,63.69 27.07,63.58 IC2.7
  Top 0.203: DISPBOARD.7 v0.54,17.45 v0.53,17.46 | v27.02,63.6 26.96,63.66 26.96,63.69
  Bottom 0.203: v0.53,17.46 6.18,17.46 7.13,18.41 7.13,33.16 8.66,34.69 8.66,63.39 10.56,65.29 26.13,65.29 27.02,64.39 v27.02,63.6
I2C0_SDA  (via drill 0.15)
  Top 0.2: 27.34,64.19 R38.2 | IC2.6 27.47,62.79
  Top 0.203: DISPBOARD.6 5.82,17.95 v6.21,18.34 | 27.47,62.79 v27.68,63 27.68,63.85 27.34,64.19
  Bottom 0.203: v6.21,18.34 6.21,18.76 6.75,19.3 6.75,33.32 8.28,34.85 8.28,63.55 10.4,65.67 26.34,65.67 27.68,64.33 v27.68,63
I2C1_SCL  (via drill 0.15)
  Top 0.2: R38.3 28.14,63.83 28.31,63.66 v28.31,63.58 28.31,62.64 27.87,62.19 IC2.5
  Top 0.203: RELAYBOARD.8 5.72,32.55 5.89,32.38 6.79,32.38 7.62,33.21 7.62,39.58 4.1,43.1 4.1,50.06 5.53,51.49 11.01,51.49 v11.17,51.33 | v11.17,56.21 8.75,58.63 v8.75,64.88 | IC6.6 30.47,71.08 30.65,70.9 30.65,70.18 28.85,68.38 23.85,68.38 22.96,67.49 22.96,66.89 v23.27,66.58
  Bottom 0.203: v11.17,51.33 10.95,51.55 10.95,55.99 v11.17,56.21 | v8.75,64.88 8.99,64.88 10.17,66.05 23.25,66.05 | v28.31,63.58 28.06,63.83 28.06,64.49 26.5,66.05 23.25,66.05 | v23.27,66.58 23.27,66.07 23.25,66.05
I2C1_SDA  (via drill 0.15)
  Top 0.2: R38.4 29.31,64.2 v29.31,63.58 29.31,63.04 28.27,62 IC2.4
  Top 0.203: RELAYBOARD.7 5.68,32.05 5.73,32 6.95,32 8,33.05 8,39.74 4.48,43.26 4.48,49.9 5.69,51.11 10.54,51.11 10.92,50.73 11.78,50.73 v11.81,50.69 | v11.55,55.42 11.37,55.61 10.92,55.61 10.57,55.96 10.57,56.28 8.37,58.47 8.37,64.4 8.15,64.63 8.15,65.35 v8.5,65.7 | IC6.5 29.99,70.06 28.69,68.76 23.69,68.76 22.06,67.13 v22.06,67.05 v22.05,67.04
  Bottom 0.203: v11.81,50.69 11.81,51.55 11.33,52.03 11.33,55.2 v11.55,55.42 | v8.5,65.7 9.25,65.7 9.99,66.44 19.55,66.44 19.56,66.43 21.44,66.43 v22.05,67.04 22.19,67.18 23.52,67.18 24.26,66.44 26.65,66.44 29.31,63.78 v29.31,63.58
KEY_0  (via drill 0.15)
  Top 0.203: DISPBOARD.12 6.1,14.95 v6.18,15.03 | IC2.15 23.06,59.87 21.94,60.99 20.87,60.99 20.62,61.24 20.62,61.94 v20,62.56
  Bottom 0.203: v6.18,15.03 6.71,15.03 8.68,16.99 8.68,32.55 11.06,34.93 11.06,40.52 10.19,41.4 10.19,56.77 13.04,59.62 19.13,59.62 20.63,61.12 20.63,61.93 v20,62.56
KEY_1  (via drill 0.15)
  Top 0.203: DISPBOARD.11 0.55,15.45 v0.53,15.43 | IC2.16 22.92,59.47 21.79,60.6 20.68,60.6 19.98,61.3 v19.98,61.64
  Bottom 0.203: v0.53,15.43 0.73,15.64 6.76,15.64 8.28,17.16 8.28,32.7 10.68,35.09 10.68,40.37 9.8,41.24 9.8,56.93 12.88,60 18.87,60 19.98,61.11 v19.98,61.64
KEY_2  (via drill 0.15)
  Top 0.203: DISPBOARD.10 6.14,15.95 v6.46,16.27 | IC2.17 22.78,59.07 21.67,60.18 20.55,60.18 19.35,61.38 19.35,62.16 v19.23,62.16
  Bottom 0.203: v6.46,16.27 6.46,16.64 7.9,18.08 7.9,32.86 10.29,35.25 10.29,40.21 9.42,41.08 9.42,57.1 12.7,60.38 18.69,60.38 19.33,61.01 19.33,62.16 v19.23,62.16
KEY_3  (via drill 0.15)
  Top 0.203: DISPBOARD.9 v0.53,16.45 | v18.71,61.45 20.4,59.77 21.54,59.77 22.64,58.67 IC2.18
  Bottom 0.203: v0.53,16.45 5.71,16.45 7.52,18.26 7.52,33.02 9.04,34.54 9.04,57.29 12.51,60.76 18.02,60.76 v18.71,61.45
LCD_BL  (via drill 0.15, 0.2)
  Top 0.2: v25.9,62.84 26.28,62.47 IC2.9
  Top 0.203: DISPBOARD.13 0.56,14.45 v0.53,14.42
  Bottom 0.203: v0.53,14.42 6.66,14.42 9.06,16.82 9.06,32.39 11.44,34.78 11.44,40.68 10.57,41.55 10.57,56.58 13.22,59.24 19.32,59.24 21.03,60.95 21.03,63.84 22.1,64.91 24.74,64.91 25.01,64.64 25.01,63.73 25.65,63.09 25.66,63.09 v25.9,62.84
LCD_CS  (via drill 0.15)
  Top 0.203: IC2.12 25.06,61.52 24.12,62.46 v24.12,62.88 | DISPBOARD.19 0.55,11.45 v0.53,11.43
  Bottom 0.203: v24.12,62.88 23.99,62.88 23.22,62.11 23.22,54.85 28.98,49.09 28.98,47.59 27.89,46.5 24.46,46.5 22.37,44.41 22.37,40.49 19.76,37.88 14.59,37.88 13.38,36.67 13.38,31.01 11,28.62 11,15.24 10.07,14.32 8.87,14.32 8.19,13.64 2.73,13.64 v0.53,11.43
LCD_DC  (via drill 0.15, 0.2)
  Top 0.2: v25.91,63.72 25.92,63.72 26.67,62.98 IC2.8
  Top 0.203: DISPBOARD.18 v6.11,11.95
  Bottom 0.203: v6.11,11.95 7.12,10.94 10.23,10.94 11.51,12.22 11.51,16.43 12.23,17.15 12.23,18.47 11.76,18.94 11.76,28.31 14.15,30.7 14.15,36.34 14.94,37.12 20.08,37.12 23.13,40.17 23.13,44.09 24.77,45.73 29.75,45.73 30.19,46.17 30.19,47.05 30.13,47.11 30.13,49.57 29.15,50.55 29.15,52.28 28.44,52.99 25.63,52.99 23.6,55.01 23.6,59.6 26.64,62.64 26.64,63 26.16,63.47 v25.91,63.72
LCD_MISO  (via drill 0.15)
  Top 0.2: 25.47,61.84 IC2.11
  Top 0.203: DISPBOARD.15 v0.53,13.45 | v24.02,64.3 24.75,63.58 24.75,62.55 25.46,61.84 25.47,61.84
  Bottom 0.203: v0.53,13.45 1.09,14.02 8.01,14.02 8.99,15 8.99,15.64 9.84,16.49 9.84,29.08 12.22,31.46 12.22,37.2 14.05,39.03 19.29,39.03 21.22,40.96 21.22,47.06 21.8,47.64 27.42,47.64 27.84,48.06 27.84,48.62 22.08,54.38 22.08,62.53 21.55,63.05 21.55,63.8 22.25,64.5 23.82,64.5 v24.02,64.3
LCD_MOSI  (via drill 0.15)
  Top 0.203: DISPBOARD.16 5.62,12.95 7.28,14.61 8.58,14.61 9.76,15.78 v10,15.78 | v22.18,63.29 24.27,61.19 IC2.14
  Bottom 0.203: v10,15.78 10,16.09 10.23,16.32 10.23,28.93 12.6,31.3 12.6,37.01 14.24,38.65 19.45,38.65 21.61,40.8 21.61,46.91 21.96,47.26 27.58,47.26 28.22,47.9 28.22,48.78 22.46,54.54 22.46,63 v22.18,63.29
LCD_RES  (via drill 0.15)
  Top 0.203: DISPBOARD.14 5.99,13.95 7.26,15.22 v8.32,15.22 | v27.19,48.34 26.58,48.95 26.58,51.98 26.27,52.29 IC2.34
  Bottom 0.203: v8.32,15.22 8.32,15.52 9.45,16.65 9.45,29.23 11.83,31.61 11.83,37.35 13.88,39.41 19.13,39.41 20.84,41.12 20.84,47.22 21.96,48.34 v27.19,48.34
LCD_SCLK  (via drill 0.15)
  Top 0.203: DISPBOARD.17 5.66,12.45 7.42,14.21 8.73,14.21 9.46,14.94 v9.83,14.94 | v22.82,63.86 22.82,63.22 24.67,61.37 IC2.13
  Bottom 0.203: v9.83,14.94 10.04,14.94 10.61,15.51 10.61,28.78 12.99,31.16 12.99,36.84 14.42,38.26 19.6,38.26 21.99,40.65 21.99,44.57 24.3,46.88 27.74,46.88 28.6,47.74 28.6,48.94 22.84,54.7 22.84,63.84 v22.82,63.86
MCP_DSP_RST  (via drill 0.15)
  Top 0.203: DISPBOARD.20 6.17,10.95 6.83,11.61 6.83,13.08 7.57,13.83 8.89,13.83 9.28,14.22 10.38,14.22 11.62,15.46 v11.62,17.73 | v27.57,51.36 27.36,51.57 27.36,52.3 27.07,52.59 IC2.36
  Bottom 0.203: v11.62,17.73 11.38,17.97 11.38,28.47 13.77,30.86 13.77,36.49 14.78,37.5 19.92,37.5 22.75,40.33 22.75,44.25 24.61,46.12 28.05,46.12 29.36,47.43 29.36,49.25 27.57,51.05 v27.57,51.36
MCP_REL_RST  (via drill 0.15)
  Top 0.203: IC2.35 26.67,52.43 26.96,52.14 26.96,49.42 27.79,48.59 27.79,48.09 27.41,47.71 16.21,47.71 11.44,52.48 v6.88,52.48 | v6.27,36.05 RELAYBOARD.15
  Bottom 0.203: v6.88,52.48 7.14,52.23 7.14,36.92 v6.27,36.05
N$1
  Top 0.203: IC1.10 19.92,35.07 20.38,34.61 R11.2
N$2
  Top 0.203: ETH1.10 14.49,5.29 18.93,9.72 18.93,16.48 20.23,17.78 20.23,21.92 22.69,24.38 22.69,28.93 22.31,29.3 R9.2
N$3
  Top 0.203: R10.2 23.46,29.31 23.07,28.92 23.07,24.22 20.61,21.76 20.61,17.57 19.31,16.27 19.31,9.67 23.69,5.29 ETH1.12
N$4
  Top 0.203: IC1.22 23.31,42.08 24.3,43.07 C6.1
N$5
  Top 0.203: IC1.20 24.42,41.08 C7.1
N$7
  Top 0.2: IC1.30 18.42,46.22 17.83,46.81 10.54,46.81 R13.1 6.69,47.28 6.16,47.81 X1.3 6.63,49.05 C9.1
N$14
  Top 0.2: R16.1 15.64,58.42 15.55,58.51 | 15.55,58.51 15.48,58.59 | 15.48,58.59 X2.3 15.46,59.73 15.17,60.02 R15.2 | 15.12,58.23 15.48,58.59 | C20.1 14.92,57.88 15.55,58.51
N$17
  Top 0.2: IC2.26 22.53,55.47 22.18,55.12 17.11,55.12
  Top 0.203: RESET.3 12.06,71.11 12.06,65 9.13,62.07 9.13,58.79 11.11,56.81 11.42,56.81 11.78,56.46 11.78,56.14 12.8,55.12 17.11,55.12
  Top 0.508: R50.2 15.41,70.41 14.69,71.13 12.09,71.13 12.06,71.11 | RESET.3 RESET.4
N$23
  Top 0.203: R28.2 26.04,72.08 IC6.1 26.98,73.02 27.22,73.25 R27.1
QSPI_SCLK
  Top 0.2: IC2.52 31.36,58.27 32.45,59.36 35.5,59.36 35.91,59.77 IC4.6
QSPI_SD0
  Top 0.2: IC2.53 31.23,58.67 32.3,59.74 34.23,59.74 34.65,60.16 IC4.5
QSPI_SD1
  Top 0.2: IC2.55 30.96,59.47 35.4,63.91 35.4,67.6 35.5,67.7 36.9,67.7 37.19,67.42 IC4.2
QSPI_SD2
  Top 0.2: IC2.54 31.1,59.07 35.91,63.89 IC4.3
QSPI_SD3
  Top 0.2: IC2.51 31.5,57.87 32.61,58.98 35.87,58.98 37.19,60.3 IC4.7
RCT
  Top 0.2: R6.1 21.2,27.66 21.05,27.81 19.45,27.81 19.43,27.83 18.27,27.83 17.86,27.83 17.7,27.67 R5.1
  Top 0.203: ETH1.5 16.82,16.77 15.96,16.77 15.45,17.28 15.45,22.48 16.58,23.61 C1.1
  Top 0.305: C1.1 R5.1
RD_N  (via drill 0.15)
  Top 0.121: C3.2 19.31,26.74 19.31,26.16 arc-90 19.16,26 18.75,26 arc90 18.28,25.53 18.28,25.51 arc90 18.75,25.05 20.17,25.05 arc-90 20.32,24.89 20.32,24.87 arc-90 20.17,24.71 18.75,24.71 arc90 18.28,24.25 18.28,24.23 arc90 18.75,23.76 20.19,23.76 arc-90 20.35,23.61 20.35,23.59 arc-90 20.19,23.43 18.75,23.43 arc90 18.28,22.96 18.28,22.94 arc90 18.75,22.48 19.16,22.48 arc-90 19.31,22.32 19.31,22.11 18.89,21.69 16.45,21.69 v16.45,21.95
  Bottom 0.121: v16.45,21.95 16.45,21.69 17.21,21.69 18.04,20.86 18.04,18.64 arc45 18.14,18.39 arc45 18.49,18.24 ETH1.6
RD_P  (via drill 0.15)
  Top 0.121: C4.2 19.63,26.74 19.63,26.16 arc-90 19.16,25.69 18.75,25.69 arc90 18.59,25.53 18.59,25.51 arc90 18.75,25.36 20.19,25.36 arc-90 20.66,24.89 20.66,24.87 arc-90 20.19,24.4 18.75,24.4 arc90 18.59,24.25 18.59,24.23 arc90 18.75,24.07 20.19,24.07 arc-90 20.66,23.61 20.66,23.59 arc-90 20.19,23.12 18.75,23.12 arc90 18.59,22.96 18.59,22.94 arc90 18.75,22.79 19.16,22.79 arc-90 19.63,22.32 19.63,21.98 19.02,21.37 16.45,21.37 v16.45,21.11
  Bottom 0.121: v16.45,21.11 16.45,21.37 17.09,21.37 17.71,20.75 17.71,18.64 arc-45 17.61,18.39 arc-45 17.26,18.24 ETH1.4
RDC_RD_N
  Top 0.121: R4.2 18.92,30.31 19.31,29.92 19.31,28.94 C3.1 18.84,28.47 R5.2
RDC_RD_P
  Top 0.121: R3.2 19.65,29.96 19.65,28.85 20.03,28.47 C4.1 R6.2
RP_XI
  Top 0.2: IC2.20 21.72,57.87 18.81,60.79 17.13,60.79 17.01,60.91 C19.1 13.09,61.47 | R15.1 11.62,61.47 13.09,61.47 | X2.1 13.09,62.48 13.09,61.47
RP_XO
  Top 0.2: IC2.21 21.59,57.47 18.65,60.41 17.1,60.41 17.01,60.32 R16.2
RX_RD_N
  Top 0.121: IC1.5 17.42,35.26 17.51,35.17 17.51,34.09 17.94,33.66 arc-90 17.94,33.44 17.84,33.33 arc90 17.84,32.67 17.86,32.65 arc90 18.52,32.65 18.63,32.75 arc-90 18.85,32.75 19.3,32.3 19.3,32.01 18.9,31.61 R4.1
RX_RD_P
  Top 0.121: IC1.6 17.92,35.27 17.83,35.17 17.83,34.21 18.16,33.88 arc-90 18.16,33.22 18.06,33.11 arc90 18.06,32.89 18.08,32.87 arc90 18.3,32.87 18.41,32.97 arc-90 19.07,32.97 19.62,32.42 19.62,32.01 arc-45 19.67,31.99 R3.1
SPI0_MISO  (via drill 0.2 pad 0.3)
  Top 0.2: IC2.27 22.73,55.07 22.36,54.7 17.47,54.7 17.16,54.39 17.16,53.51 v17.38,53.29 | v18.05,41.7 16.78,41.7 16.42,42.06 IC1.34
  Bottom 0.2: v17.38,53.29 17.46,53.21 17.46,43.07 17.88,42.65 17.88,41.87 v18.05,41.7
SPI0_MOSI  (via drill 0.2 pad 0.3)
  Top 0.2: IC2.30 24.67,53.29 24.52,53.14 19.85,53.14 18.39,51.68 v16.44,51.68 | v16.01,41.59 15.92,41.67 IC1.35
  Bottom 0.2: v16.44,51.68 16.71,51.42 16.71,42.8 16.55,42.65 16.55,42.13 v16.01,41.59
SPI0_SCK  (via drill 0.2 pad 0.3)
  Top 0.2: IC2.29 20.01,53.83 18.71,52.53 v16.84,52.53 v16.83,52.53 | IC1.33 16.92,42.65 v17.18,42.39
  Bottom 0.2: v16.83,52.53 17.08,52.28 17.08,42.49 v17.18,42.39
SWCLK  (via drill 0.15)
  Top 0.2: IC2.24 22.23,56.27 21.85,55.9 17.23,55.9
  Top 0.203: 17.23,55.9 13.1,55.9 12.54,56.46 12.54,56.78 10.42,58.89 10.42,59.29 10.05,59.67 v10.05,59.91 | v10.29,64.09 10.07,64.31 10.07,66.07 9.05,67.09 7.79,67.09 7.22,66.52 7.22,63.97 6.19,62.94 3.75,62.94 2.99,62.18 2.99,62.16 2.9,62.07 2.9,57.7 DBG2.1
  Bottom 0.203: v10.05,59.91 10.05,63.84 v10.29,64.09
SWDIO  (via drill 0.15)
  Top 0.203: DBG2.3 4.62,62.56 6.38,62.56 7.6,63.78 7.6,66.36 7.95,66.71 8.89,66.71 9.69,65.91 9.69,63.57 v9.44,63.32 | v9.82,59.04 9.82,58.64 11.26,57.2 11.58,57.2 12.16,56.62 12.16,56.3 12.96,55.5 17.27,55.5 22.03,55.5 22.4,55.87 IC2.25
  Bottom 0.203: v9.44,63.32 9.44,59.42 v9.82,59.04
TCT
  Top 0.2: R40.1 11.01,30.3 C2.1
  Top 0.203: R40.1 12.12,22.04 14.07,20.08 ETH1.2
TD_N  (via drill 0.15)
  Top 0.121: v13.03,23.71 13.03,23.45 14.47,23.45 14.78,23.76 14.78,24.38 arc90 14.63,24.54 14.44,24.54 arc-90 13.97,25 13.97,25.24 arc-90 14.44,25.7 14.63,25.7 arc90 14.78,25.86 14.78,26.09 arc90 14.63,26.25 14.44,26.25 arc-90 13.97,26.72 13.97,26.95 arc-90 14.44,27.42 14.63,27.42 arc90 14.78,27.57 14.78,27.81 arc90 14.63,27.97 14.44,27.97 arc-90 13.97,28.43 13.97,28.67 arc-90 14.44,29.14 14.63,29.14 arc90 14.78,29.29 14.78,29.9 R1.2 R8.1
  Bottom 0.121: v13.03,23.71 13.03,23.45 14,23.45 15.4,22.05 15.4,17.78 arc-45 15.25,17.43 14.39,16.57 arc45 14.25,16.22 14.25,16.2 arc90 14.75,15.7 ETH1.3
TD_P  (via drill 0.15)
  Top 0.121: v13.03,22.87 13.03,23.13 14.61,23.13 15.1,23.62 15.1,24.38 arc90 14.63,24.85 14.44,24.85 arc-90 14.28,25 14.28,25.24 arc-90 14.44,25.39 14.63,25.39 arc90 15.1,25.86 15.1,26.09 arc90 14.63,26.56 14.46,26.56 arc-90 14.3,26.72 14.3,26.95 arc-90 14.46,27.11 14.63,27.11 arc90 15.1,27.57 15.1,27.81 arc90 14.63,28.28 14.44,28.28 arc-90 14.28,28.43 14.28,28.67 arc-90 14.44,28.82 14.63,28.82 arc90 15.1,29.29 15.1,29.92 R2.2 R7.1
  Bottom 0.121: v13.03,22.87 13.03,23.13 13.88,23.13 15.08,21.93 15.08,17.91 arc-45 14.94,17.56 14.08,16.7 arc45 13.93,16.35 13.93,16.2 arc-90 13.43,15.7 ETH1.1
TX_TD_N
  Top 0.121: IC1.1 15.42,35.19 15.52,35.09 15.52,34.74 14.97,34.19 arc45 14.78,33.74 14.78,33.62 arc90 15.25,33.16 15.64,33.16 arc-90 15.79,33 15.79,32.97 arc-90 15.64,32.82 15.25,32.82 arc90 14.78,32.35 14.78,32 R1.1
TX_TD_P
  Top 0.121: IC1.2 15.92,35.18 15.84,35.09 15.84,34.62 15.2,33.98 arc45 15.1,33.73 15.1,33.62 arc90 15.25,33.47 15.64,33.47 arc-90 16.11,33 16.11,32.97 arc-90 15.64,32.51 15.25,32.51 arc90 15.1,32.35 15.1,31.99 R2.1
UART0_RX  (via drill 0.15, 0.2)
  Top 0.2: IC2.2 29.07,61.3 29.41,61.64 v29.7,61.64
  Top 0.203: RELAYBOARD.10 v0.54,33.55 v0.53,33.56 | v8.58,68.53 6.8,68.53 v6.77,68.56
  Bottom 0.203: v0.53,33.56 3.6,33.56 4.79,34.74 7.1,34.74 7.52,35.17 7.52,68.17 7.13,68.56 v6.77,68.56 DBG1.1 | v29.7,61.64 30.01,61.64 30.4,62.03 30.4,64.32 26.48,68.24 8.87,68.24 v8.58,68.53
UART0_TX  (via drill 0.15, 0.2)
  Top 0.2: IC2.3 28.67,61.84 29.36,62.53 v29.74,62.53
  Top 0.203: RELAYBOARD.11 6.08,34.05 v6.11,34.08
  Bottom 0.203: v6.11,34.08 6.97,34.08 7.9,35.01 7.9,67.89 | DBG1.3 4.26,73.32 6.85,73.32 7.9,72.27 7.9,67.89 | v29.74,62.53 30.02,62.81 30.02,64.16 26.32,67.86 7.93,67.86 7.9,67.89
USB_BOOT
  Top 0.508: BOOT.2 BOOT.1 42.02,69.53 R19.1
USB_DP_N
  Top 0.155: R21.2 35.48,20.58 35.48,21.91 arc-90 35.99,22.43 36.16,22.43 arc90 36.34,22.6 36.34,22.77 arc90 36.16,22.94 35.13,22.94 arc-90 34.62,23.46 34.62,23.63 arc-90 35.13,24.15 36.16,24.15 arc90 36.34,24.32 36.34,24.49 arc90 36.16,24.66 35.13,24.66 arc-90 34.62,25.18 34.62,25.35 arc-90 35.13,25.87 36.16,25.87 arc90 36.34,26.04 36.34,26.21 arc90 36.16,26.38 35.99,26.38 arc-90 35.48,26.9 35.48,31.52 40.73,36.77 40.73,53.23 38.18,55.78 32.35,55.78 32.26,55.87 IC2.46
USB_DP_P
  Top 0.155: R22.2 35.82,20.57 35.82,21.91 arc-90 35.99,22.08 36.16,22.08 arc90 36.68,22.6 36.68,22.77 arc90 36.16,23.29 35.43,23.29 arc-90 35.26,23.46 35.26,23.63 arc-90 35.43,23.8 36.16,23.8 arc90 36.68,24.32 36.68,24.49 arc90 36.16,25.01 35.13,25.01 arc-90 34.96,25.18 34.96,25.35 arc-90 35.13,25.52 36.16,25.52 arc90 36.68,26.04 36.68,26.21 arc90 36.16,26.73 35.99,26.73 arc-90 35.82,26.9 35.82,31.38 41.07,36.63 41.07,53.37 38.32,56.12 32.5,56.12 32.35,56.27 IC2.47
USB_SHIELD
  Top 0.508: C54.1 R39.1 41.07,7.96 40.42,7.31 USBC.S2 USBC.S4 | USBC.S3 USBC.S1
  Top 0.61: USBC.S3 31.78,1.41 32.27,0.92 39.82,0.92 40.42,1.52 USBC.S4
V_USB  (via drill 0.15)
  Top 0.203: IC2.38 27.87,52.39 v28.12,52.14
  Top 0.406: v29.59,46.8 29.59,22.75 27.24,20.41 27.24,14.68 27.75,14.17 R26.1
  Top 0.508: R26.1 30.13,14.17 R25.2
  Bottom 0.203: v28.12,52.14 28.27,51.99 28.27,50.88 29.75,49.41 29.75,46.95 v29.59,46.8
VBUS  (via drill 0.15)
  Top 0.203: USBC.A4 33.7,7.08 USBC.B9 | USBC.B4 38.5,7.08 USBC.A9
  Top 0.254: USBC.A9 38.48,7.25 | IC5.1 39.83,18.19 39.82,18.18
  Top 0.508: IC5.1 39.86,19.12 39.99,19.25 41.5,19.25 41.76,18.99 IC5.3
  Top 0.61: C26.1 32.46,9.71 33.7,8.46 v33.7,8.14 | C36.1 38.9,14.94 37.9,13.94 37.9,11.52 38.5,10.92 v38.5,9.87 38.5,7.08 | C26.1 32.22,10.68 R20.1 C27.1 31.42,14.15 R25.1 31.44,18.1 30.69,18.85 VBUS.TP | ESD1.4 32.8,10.28 C26.1 | C36.1 39.86,15.01 39.86,16.41 40,16.41 C40.1 | C36.1 39.82,15.05 39.82,18.18 | 33.7,6.7 33.7,7.08 v33.7,8.14 | v33.71,8.15 v33.7,8.14
  Bottom 0.61: v38.5,9.87 38.5,8.08 37.89,7.47 34.39,7.47 v33.71,8.15
VREF
  Top 0.406: REF1.1 36.94,47.79 C21.1 38.4,48.09 | 38.4,48.09 38.53,48.09 C22.1 | 38.57,45.4 R17.1 38.44,45.5 37.2,45.5 36.75,45.05 IC3.3 | 38.57,45.4 38.57,47.92 38.4,48.09 | VREF.TP 36.45,39.55 37.3,40.4 38.2,40.4 39.6,41.8 39.6,45.2 39.4,45.4 38.57,45.4
XO
  Top 0.2: R13.2 10.08,45.99 | 10.08,45.99 10.52,46.43 17.61,46.43 17.92,46.12 IC1.31 | C8.1 8.06,44.02 X1.1 8.63,45.43 9.19,45.99 10.08,45.99

### Text on the board
tPlace: Controller Board REV 2.0
tNames: R7 | R4
bNames: github.com/DvidMakesThings/HW_10-In-Rack_PDU / David Sipos @2025